# Altium project InterfaceB.PrjPcb (part 1 of 2)
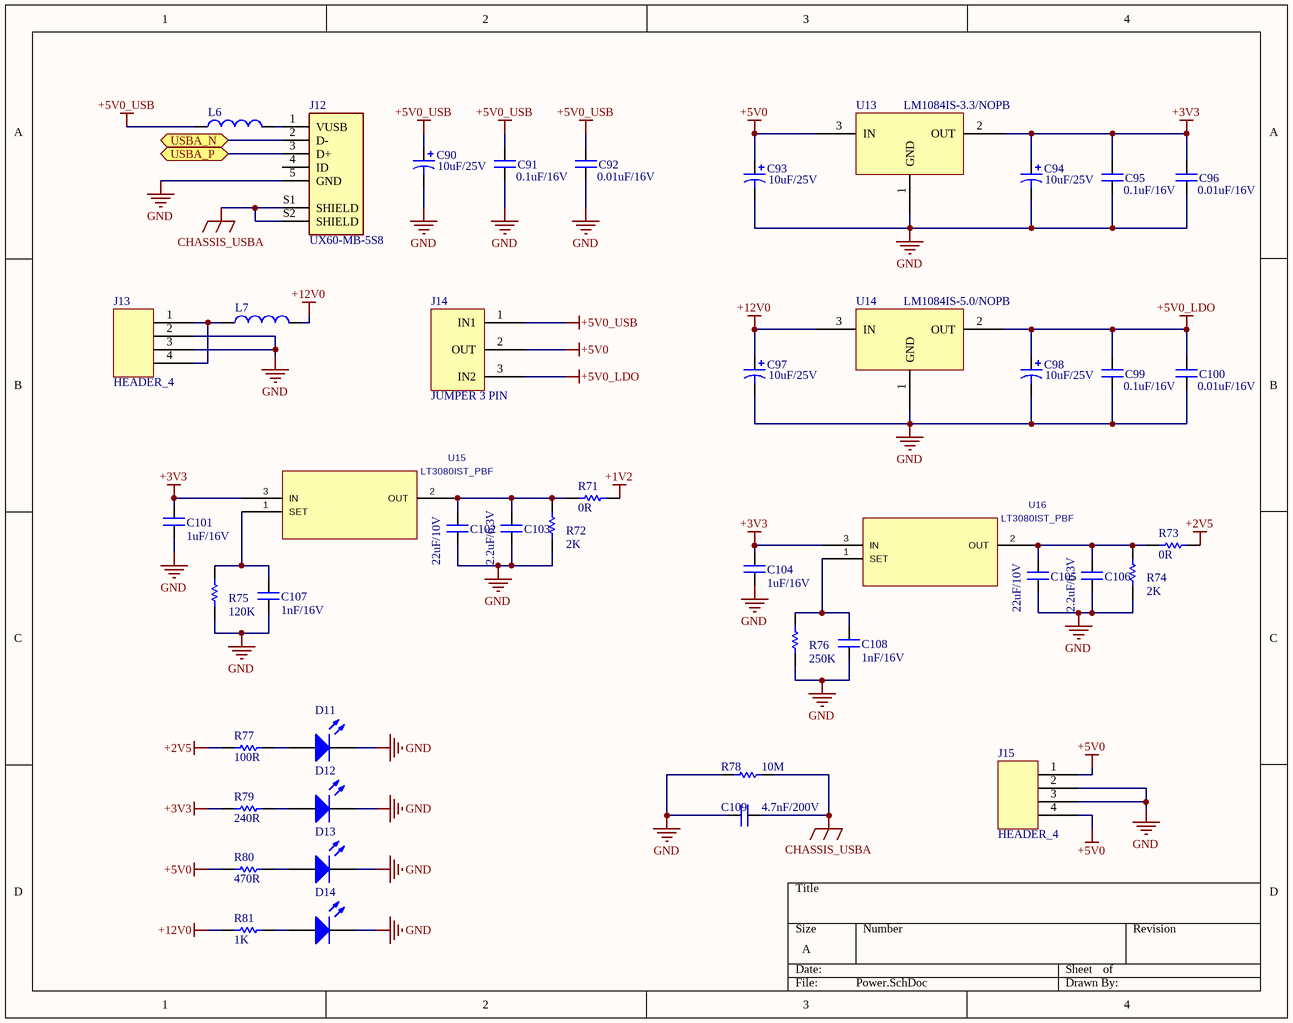
[diagram p0: Power.SchDoc]
12 sheets, 260 parts. Net scope: flat (ports and power ports of the same name join across sheets).
Board file: PCB1.PcbDoc
Sheets:
  Power.SchDoc
  InterfacesB_FPGA.SchDoc
  InterfacesB_Decoupling.SchDoc
  InterfacesB_NONISO232a.SchDoc
  InterfacesB_NONISO232b.SchDoc
  InterfacesB_NONISO422a.SchDoc
  InterfacesB_NONISO422b.SchDoc
  InterfacesB_RGMII_Ethernet.SchDoc
  InterfacesA_USBFTDI.SchDoc
  InterfacesB_SHIFTER_LEDS.SchDoc
  InterfacesB_CONNECTORS.SchDoc
  Mechanical.SchDoc

## Sheet Power.SchDoc
size A; DocumentNumber: 1; SheetNumber: 1

### Parts
C90  value 10uF/25V  [CASE-C]  (hidden comment: CASE-C)
C91  value 0.1uF/16V  [CAP_0805]  (hidden comment: CAP_0805)
C92  value 0.01uF/16V  [CAP_0805]  (hidden comment: CAP_0805)
C93  value 10uF/25V  [CASE-C]  (hidden comment: CASE-C)
C94  value 10uF/25V  [CASE-C]  (hidden comment: CASE-C)
C95  value 0.1uF/16V  [CAP_0805]  (hidden comment: CAP_0805)
C96  value 0.01uF/16V  [CAP_0805]  (hidden comment: CAP_0805)
C97  value 10uF/25V  [CASE-C]  (hidden comment: CASE-C)
C98  value 10uF/25V  [CASE-C]  (hidden comment: CASE-C)
C99  value 0.1uF/16V  [CAP_0805]  (hidden comment: CAP_0805)
C100  value 0.01uF/16V  [CAP_0805]  (hidden comment: CAP_0805)
C101  value 1uF/16V  [CAP_0805]  (hidden comment: CAP_0805)
C102  value 22uF/10V  [CAP_0805]  (hidden comment: CAP_0805)
C103  value 2.2uF/6.3V  [CAP_0805]  (hidden comment: CAP_0805)
C104  value 1uF/16V  [CAP_0805]  (hidden comment: CAP_0805)
C105  value 22uF/10V  [CAP_0805]  (hidden comment: CAP_0805)
C106  value 2.2uF/6.3V  [CAP_0805]  (hidden comment: CAP_0805)
C107  value 1nF/16V  [CAP_0805]  (hidden comment: CAP_0805)
C108  value 1nF/16V  [CAP_0805]  (hidden comment: CAP_0805)
C109  value 4.7nF/200V  [CAP_0805]  (hidden comment: CAP_0805)
D11  LED_0603  [LED_0603]  (value not drawn)
D12  LED_0603  [LED_0603]  (value not drawn)
D13  LED_0603  [LED_0603]  (value not drawn)
D14  LED_0603  [LED_0603]  (value not drawn)
J12  UX60-MB-5S8  [UX60-MB-5S8]
J13  HEADER_4  [HEADER_4]
J14  JUMPER 3 PIN  [JUMPER 3 PIN]
J15  HEADER_4  [HEADER_4]
L6  IND_0805  [IND_0805]  (value not drawn)
L7  IND_0805  [IND_0805]  (value not drawn)
R71  value 0R  [RES_0805]  (hidden comment: RES_0805)
R72  value 2K  [RES_0805]  (hidden comment: RES_0805)
R73  value 0R  [RES_0805]  (hidden comment: RES_0805)
R74  value 2K  [RES_0805]  (hidden comment: RES_0805)
R75  value 120K  [RES_0805]  (hidden comment: RES_0805)
R76  value 250K  [RES_0805]  (hidden comment: RES_0805)
R77  value 100R  [RES_0805]  (hidden comment: RES_0805)
R78  value 10M  [RES_0805]  (hidden comment: RES_0805)
R79  value 240R  [RES_0805]  (hidden comment: RES_0805)
R80  value 470R  [RES_0805]  (hidden comment: RES_0805)
R81  value 1K  [RES_0805]  (hidden comment: RES_0805)
U13  LM1084IS-3.3/NOPB  [LM1084IS-3.3/NOPB]
U14  LM1084IS-5.0/NOPB  [LM1084IS-5.0/NOPB]
U15  LT3080IST_PBF  [LT3080IST_PBF]
U16  LT3080IST_PBF  [LT3080IST_PBF]

### Ports
USBA_N (bidir), USBA_P (bidir)

### Nets
+1V2: R71.1
+2V5: R73.1 R77.1
+3V3: C94.A C95.2 C96.2 C101.2 C104.2 R79.1 U13.2(OUT) U15.3(IN) U16.3(IN)
+5V0: C93.A J14.2(OUT) J15.1 J15.4 R80.1 U13.3(IN)
+5V0_LDO: C98.A C99.2 C100.2 J14.3(IN2) U14.2(OUT)
+5V0_USB: C90.A C91.2 C92.2 J14.1(IN1) L6.1
+12V0: C97.A L7.2 R81.1 U14.3(IN)
CHASSIS_USBA: C109.1 J12.S1(SHIELD) J12.S2(SHIELD) R78.1
GND: C90.K C91.1 C92.1 C93.K C94.K C95.1 C96.1 C97.K C98.K C99.1 C100.1 C101.1 C102.1 C103.1 C104.1 C105.1 C106.1 C107.1 C108.1 C109.2 D11.2(K) D12.2(K) D13.2(K) D14.2(K) J12.5(GND) J13.2 J13.3 J15.2 J15.3 R72.1 R74.1 R75.1 R76.1 R78.2 U13.1(GND) U14.1(GND)
USBA_N: J12.2(D-) ; port USBA_N
USBA_P: J12.3(D+) ; port USBA_P
NetC102_2: C102.2 C103.2 R71.2 R72.2 U15.2(OUT)
NetC105_2: C105.2 C106.2 R73.2 R74.2 U16.2(OUT)
NetC107_2: C107.2 R75.2 U15.1(SET)
NetC108_2: C108.2 R76.2 U16.1(SET)
NetD11_1: D11.1(A) R77.2
NetD12_1: D12.1(A) R79.2
NetD13_1: D13.1(A) R80.2
NetD14_1: D14.1(A) R81.2
NetJ12_1: J12.1(VUSB) L6.2
NetJ13_1: J13.1 J13.4 L7.1

Not connected (* = marked no-connect by the designer): J12 4(ID)

### Library data of the parts
J12 = UX60-MB-5S8: USB MINI TYPE B
U15 U16 = LT3080IST_PBF: Manufacturer_Part_Number: LT3080IST#PBF; Vendor: Linear Technology; SourceLibrary: LinearTech_2016-05-13_3; Built_By: EMA_UL_Team; Value: LT3080IST_PBF
U13 = LM1084IS-3.3/NOPB: Supplier 1: Digi-Key; Supplier Part Number 1: 296-35390-1-ND
U14 = LM1084IS-5.0/NOPB: Supplier 1: Digi-Key; Supplier Part Number 1: 296-35390-1-ND

## Sheet InterfacesB_FPGA.SchDoc
size A; DocumentNumber: 2; SheetNumber: 2
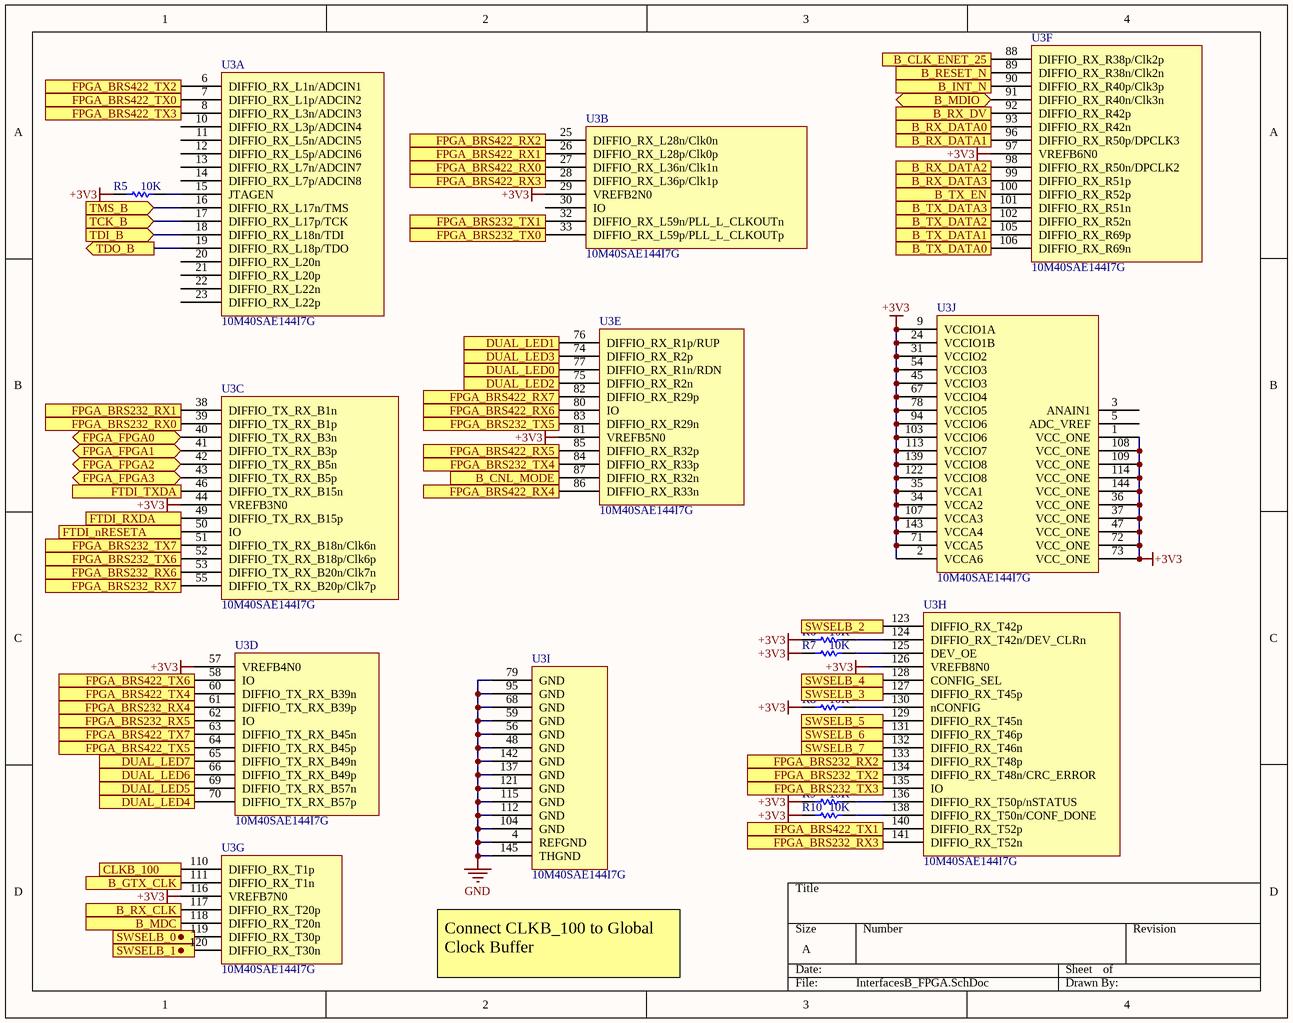
[diagram p1: InterfacesB_FPGA.SchDoc]

### Parts
R5  value 10K  [RES_0805]  (hidden comment: RES_0805)
R6  value 10K  [RES_0805]  (hidden comment: RES_0805)
R7  value 10K  [RES_0805]  (hidden comment: RES_0805)
R8  value 10K  [RES_0805]  (hidden comment: RES_0805)
R9  value 10K  [RES_0805]  (hidden comment: RES_0805)
R10  value 10K  [RES_0805]  (hidden comment: RES_0805)
U3  10M40SAE144I7G  [10M40SAE144I7G]  (parts A,B,C,D,E,F,G,H,I,J of 10)

### Ports
B_CLK_ENET_25 (out), B_CNL_MODE (in), B_GTX_CLK (out), B_INT_N (in), B_MDC (out), B_MDIO (bidir), B_RESET_N (out), B_RX_CLK (out), B_RX_DATA0 (in), B_RX_DATA1 (in), B_RX_DATA2 (in), B_RX_DATA3 (in), B_RX_DV (in), B_TX_DATA0 (out), B_TX_DATA1 (out), B_TX_DATA2 (out), B_TX_DATA3 (out), B_TX_EN (out), CLKB_100 (out), DUAL_LED0 (out), DUAL_LED1 (out), DUAL_LED2 (out), DUAL_LED3 (out), DUAL_LED4 (out), DUAL_LED5 (out), DUAL_LED6 (out), DUAL_LED7 (out), FPGA_BRS232_RX0 (in), FPGA_BRS232_RX1 (in), FPGA_BRS232_RX2 (in), FPGA_BRS232_RX3 (in), FPGA_BRS232_RX4 (in), FPGA_BRS232_RX5 (in), FPGA_BRS232_RX6 (in), FPGA_BRS232_RX7 (in), FPGA_BRS232_TX0 (out), FPGA_BRS232_TX1 (out), FPGA_BRS232_TX2 (out), FPGA_BRS232_TX3 (out), FPGA_BRS232_TX4 (out), FPGA_BRS232_TX5 (out), FPGA_BRS232_TX6 (out), FPGA_BRS232_TX7 (out), FPGA_BRS422_RX0 (in), FPGA_BRS422_RX1 (in), FPGA_BRS422_RX2 (in), FPGA_BRS422_RX3 (in), FPGA_BRS422_RX4 (in), FPGA_BRS422_RX5 (in), FPGA_BRS422_RX6 (in), FPGA_BRS422_RX7 (in), FPGA_BRS422_TX0 (out), FPGA_BRS422_TX1 (out), FPGA_BRS422_TX2 (out), FPGA_BRS422_TX3 (out), FPGA_BRS422_TX4 (out), FPGA_BRS422_TX5 (out), FPGA_BRS422_TX6 (out), FPGA_BRS422_TX7 (out), FPGA_FPGA0 (bidir), FPGA_FPGA1 (bidir), FPGA_FPGA2 (bidir), FPGA_FPGA3 (bidir), FTDI_nRESETA (out), FTDI_RXDA (in), FTDI_TXDA (out), SWSELB_0 (in), SWSELB_1 (in), SWSELB_2 (in), SWSELB_3 (in), SWSELB_4 (in), SWSELB_5 (in), SWSELB_6 (in), SWSELB_7 (in), TCK_B (in), TDI_B (in), TDO_B (out), TMS_B (in)

### Nets
+3V3: R5.2 R6.2 R7.2 R8.2 R9.2 R10.2 U3.1(VCC_ONE) U3.2(VCCA6) U3.9(VCCIO1A) U3.24(VCCIO1B) U3.29(VREFB2N0) U3.31(VCCIO2) U3.34(VCCA2) U3.35(VCCA1) U3.36(VCC_ONE) U3.37(VCC_ONE) U3.44(VREFB3N0) U3.45(VCCIO3) U3.47(VCC_ONE) U3.54(VCCIO3) U3.57(VREFB4N0) U3.67(VCCIO4) U3.71(VCCA5) U3.72(VCC_ONE) U3.73(VCC_ONE) U3.78(VCCIO5) U3.81(VREFB5N0) U3.94(VCCIO6) U3.97(VREFB6N0) U3.103(VCCIO6) U3.107(VCCA3) U3.108(VCC_ONE) U3.109(VCC_ONE) U3.113(VCCIO7) U3.114(VCC_ONE) U3.116(VREFB7N0) U3.122(VCCIO8) U3.126(VREFB8N0) U3.139(VCCIO8) U3.143(VCCA4) U3.144(VCC_ONE)
GND: U3.4(REFGND) U3.48(GND) U3.56(GND) U3.59(GND) U3.68(GND) U3.79(GND) U3.95(GND) U3.104(GND) U3.112(GND) U3.115(GND) U3.121(GND) U3.137(GND) U3.142(GND) U3.145(THGND)
CLK_ENET_25: U3.88(DIFFIO_RX_R38p/Clk2p) ; port B_CLK_ENET_25
CLKB_100: U3.110(DIFFIO_RX_T1p) ; port CLKB_100
CNL_MODE: U3.87(DIFFIO_RX_R32n) ; port B_CNL_MODE
FPGA_BRS232_RX0: U3.39(DIFFIO_TX_RX_B1p) ; port FPGA_BRS232_RX0
FPGA_BRS232_RX1: U3.38(DIFFIO_TX_RX_B1n) ; port FPGA_BRS232_RX1
FPGA_BRS232_RX2: U3.133(DIFFIO_RX_T48p) ; port FPGA_BRS232_RX2
FPGA_BRS232_RX3: U3.141(DIFFIO_RX_T52n) ; port FPGA_BRS232_RX3
FPGA_BRS232_RX4: U3.61(DIFFIO_TX_RX_B39p) ; port FPGA_BRS232_RX4
FPGA_BRS232_RX5: U3.62(IO) ; port FPGA_BRS232_RX5
FPGA_BRS232_RX6: U3.53(DIFFIO_TX_RX_B20n/Clk7n) ; port FPGA_BRS232_RX6
FPGA_BRS232_RX7: U3.55(DIFFIO_TX_RX_B20p/Clk7p) ; port FPGA_BRS232_RX7
FPGA_BRS232_TX0: U3.33(DIFFIO_RX_L59p/PLL_L_CLKOUTp) ; port FPGA_BRS232_TX0
FPGA_BRS232_TX1: U3.32(DIFFIO_RX_L59n/PLL_L_CLKOUTn) ; port FPGA_BRS232_TX1
FPGA_BRS232_TX2: U3.134(DIFFIO_RX_T48n/CRC_ERROR) ; port FPGA_BRS232_TX2
FPGA_BRS232_TX3: U3.135(IO) ; port FPGA_BRS232_TX3
FPGA_BRS232_TX4: U3.84(DIFFIO_RX_R33p) ; port FPGA_BRS232_TX4
FPGA_BRS232_TX5: U3.83(DIFFIO_RX_R29n) ; port FPGA_BRS232_TX5
FPGA_BRS232_TX6: U3.52(DIFFIO_TX_RX_B18p/Clk6p) ; port FPGA_BRS232_TX6
FPGA_BRS232_TX7: U3.51(DIFFIO_TX_RX_B18n/Clk6n) ; port FPGA_BRS232_TX7
FPGA_BRS422_RX0: U3.27(DIFFIO_RX_L36n/Clk1n) ; port FPGA_BRS422_RX0
FPGA_BRS422_RX1: U3.26(DIFFIO_RX_L28p/Clk0p) ; port FPGA_BRS422_RX1
FPGA_BRS422_RX2: U3.25(DIFFIO_RX_L28n/Clk0n) ; port FPGA_BRS422_RX2
FPGA_BRS422_RX3: U3.28(DIFFIO_RX_L36p/Clk1p) ; port FPGA_BRS422_RX3
FPGA_BRS422_RX4: U3.86(DIFFIO_RX_R33n) ; port FPGA_BRS422_RX4
FPGA_BRS422_RX5: U3.85(DIFFIO_RX_R32p) ; port FPGA_BRS422_RX5
FPGA_BRS422_RX6: U3.80(IO) ; port FPGA_BRS422_RX6
FPGA_BRS422_RX7: U3.82(DIFFIO_RX_R29p) ; port FPGA_BRS422_RX7
FPGA_BRS422_TX0: U3.7(DIFFIO_RX_L1p/ADCIN2) ; port FPGA_BRS422_TX0
FPGA_BRS422_TX1: U3.140(DIFFIO_RX_T52p) ; port FPGA_BRS422_TX1
FPGA_BRS422_TX2: U3.6(DIFFIO_RX_L1n/ADCIN1) ; port FPGA_BRS422_TX2
FPGA_BRS422_TX3: U3.8(DIFFIO_RX_L3n/ADCIN3) ; port FPGA_BRS422_TX3
FPGA_BRS422_TX4: U3.60(DIFFIO_TX_RX_B39n) ; port FPGA_BRS422_TX4
FPGA_BRS422_TX5: U3.64(DIFFIO_TX_RX_B45p) ; port FPGA_BRS422_TX5
FPGA_BRS422_TX6: U3.58(IO) ; port FPGA_BRS422_TX6
FPGA_BRS422_TX7: U3.63(DIFFIO_TX_RX_B45n) ; port FPGA_BRS422_TX7
FPGA_FPGA0: U3.40(DIFFIO_TX_RX_B3n) ; port FPGA_FPGA0
FPGA_FPGA1: U3.41(DIFFIO_TX_RX_B3p) ; port FPGA_FPGA1
FPGA_FPGA2: U3.42(DIFFIO_TX_RX_B5n) ; port FPGA_FPGA2
FPGA_FPGA3: U3.43(DIFFIO_TX_RX_B5p) ; port FPGA_FPGA3
FTDI_RXDA: U3.49(DIFFIO_TX_RX_B15p) ; port FTDI_RXDA
FTDI_TXDA: U3.46(DIFFIO_TX_RX_B15n) ; port FTDI_TXDA
GTX_CLK: U3.111(DIFFIO_RX_T1n) ; port B_GTX_CLK
INT_N: U3.90(DIFFIO_RX_R40p/Clk3p) ; port B_INT_N
L0: U3.77(DIFFIO_RX_R1n/RDN) ; port DUAL_LED0
L1: U3.76(DIFFIO_RX_R1p/RUP) ; port DUAL_LED1
L2: U3.75(DIFFIO_RX_R2n) ; port DUAL_LED2
L3: U3.74(DIFFIO_RX_R2p) ; port DUAL_LED3
L4: U3.70(DIFFIO_TX_RX_B57p) ; port DUAL_LED4
L5: U3.69(DIFFIO_TX_RX_B57n) ; port DUAL_LED5
L6: U3.66(DIFFIO_TX_RX_B49p) ; port DUAL_LED6
L7: U3.65(DIFFIO_TX_RX_B49n) ; port DUAL_LED7
MDC: U3.118(DIFFIO_RX_T20n) ; port B_MDC
MDIO: U3.91(DIFFIO_RX_R40n/Clk3n) ; port B_MDIO
RESET_N: U3.89(DIFFIO_RX_R38n/Clk2n) ; port B_RESET_N
RST_A: U3.50(IO) ; port FTDI_nRESETA
RX_CLK: U3.117(DIFFIO_RX_T20p) ; port B_RX_CLK
RX_DATA0: U3.93(DIFFIO_RX_R42n) ; port B_RX_DATA0
RX_DATA1: U3.96(DIFFIO_RX_R50p/DPCLK3) ; port B_RX_DATA1
RX_DATA2: U3.98(DIFFIO_RX_R50n/DPCLK2) ; port B_RX_DATA2
RX_DATA3: U3.99(DIFFIO_RX_R51p) ; port B_RX_DATA3
RX_DV: U3.92(DIFFIO_RX_R42p) ; port B_RX_DV
SWSELB_2: U3.123(DIFFIO_RX_T42p) ; port SWSELB_2
SWSELB_3: U3.127(DIFFIO_RX_T45p) ; port SWSELB_3
SWSELB_4: U3.128(CONFIG_SEL) ; port SWSELB_4
SWSELB_5: U3.129(DIFFIO_RX_T45n) ; port SWSELB_5
SWSELB_6: U3.131(DIFFIO_RX_T46p) ; port SWSELB_6
SWSELB_7: U3.132(DIFFIO_RX_T46n) ; port SWSELB_7
TCK_B: U3.17(DIFFIO_RX_L17p/TCK) ; port TCK_B
TDI_B: U3.18(DIFFIO_RX_L18n/TDI) ; port TDI_B
TDO_B: U3.19(DIFFIO_RX_L18p/TDO) ; port TDO_B
TMS_B: U3.16(DIFFIO_RX_L17n/TMS) ; port TMS_B
TX_DATA0: U3.106(DIFFIO_RX_R69n) ; port B_TX_DATA0
TX_DATA1: U3.105(DIFFIO_RX_R69p) ; port B_TX_DATA1
TX_DATA2: U3.102(DIFFIO_RX_R52n) ; port B_TX_DATA2
TX_DATA3: U3.101(DIFFIO_RX_R51n) ; port B_TX_DATA3
TX_EN: U3.100(DIFFIO_RX_R52p) ; port B_TX_EN
NetR5_1: R5.1 U3.15(JTAGEN)
NetR6_1: R6.1 U3.124(DIFFIO_RX_T42n/DEV_CLRn)
NetR7_1: R7.1 U3.125(DEV_OE)
NetR8_1: R8.1 U3.130(nCONFIG)
NetR9_1: R9.1 U3.136(DIFFIO_RX_T50p/nSTATUS)
NetR10_1: R10.1 U3.138(DIFFIO_RX_T50n/CONF_DONE)

Not connected (* = marked no-connect by the designer): U3 3(ANAIN1) 5(ADC_VREF) 10(DIFFIO_RX_L3p/ADCIN4) 11(DIFFIO_RX_L5n/ADCIN5) 12(DIFFIO_RX_L5p/ADCIN6) 13(DIFFIO_RX_L7n/ADCIN7) 14(DIFFIO_RX_L7p/ADCIN8) 20(DIFFIO_RX_L20n) 21(DIFFIO_RX_L20p) 22(DIFFIO_RX_L22n) 23(DIFFIO_RX_L22p) 30(IO) 119(DIFFIO_RX_T30p) 120(DIFFIO_RX_T30n)

### Notes on the sheet
- Connect CLKB_100 to Global Clock Buffer

### Library data of the parts
U3 = 10M40SAE144I7G: IC FPGA 101 I/O 144EQFP

## Sheet InterfacesB_Decoupling.SchDoc
size A; DocumentNumber: 3; SheetNumber: 3
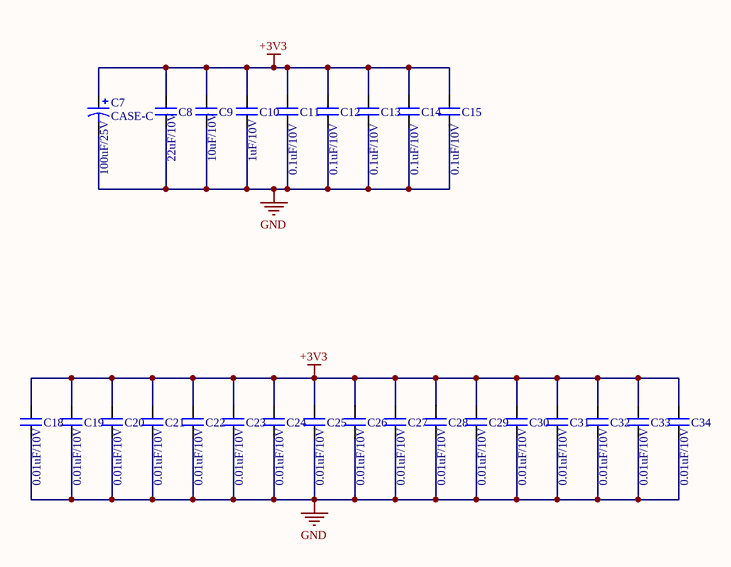
[diagram p2: InterfacesB_Decoupling.SchDoc]

### Parts
C7  CASE-C  value 100uF/25V  [CASE-C]
C8  value 22uF/10V  [CAP_0805]  (hidden comment: CAP_0805)
C9  value 10uF/10V  [CAP_0805]  (hidden comment: CAP_0805)
C10  value 1uF/10V  [CAP_0805]  (hidden comment: CAP_0805)
C11  value 0.1uF/10V  [CAP_0805]  (hidden comment: CAP_0805)
C12  value 0.1uF/10V  [CAP_0805]  (hidden comment: CAP_0805)
C13  value 0.1uF/10V  [CAP_0805]  (hidden comment: CAP_0805)
C14  value 0.1uF/10V  [CAP_0805]  (hidden comment: CAP_0805)
C15  value 0.1uF/10V  [CAP_0805]  (hidden comment: CAP_0805)
C18  value 0.01uF/10V  [CAP_0805]  (hidden comment: CAP_0805)
C19  value 0.01uF/10V  [CAP_0805]  (hidden comment: CAP_0805)
C20  value 0.01uF/10V  [CAP_0805]  (hidden comment: CAP_0805)
C21  value 0.01uF/10V  [CAP_0805]  (hidden comment: CAP_0805)
C22  value 0.01uF/10V  [CAP_0805]  (hidden comment: CAP_0805)
C23  value 0.01uF/10V  [CAP_0805]  (hidden comment: CAP_0805)
C24  value 0.01uF/10V  [CAP_0805]  (hidden comment: CAP_0805)
C25  value 0.01uF/10V  [CAP_0805]  (hidden comment: CAP_0805)
C26  value 0.01uF/10V  [CAP_0805]  (hidden comment: CAP_0805)
C27  value 0.01uF/10V  [CAP_0805]  (hidden comment: CAP_0805)
C28  value 0.01uF/10V  [CAP_0805]  (hidden comment: CAP_0805)
C29  value 0.01uF/10V  [CAP_0805]  (hidden comment: CAP_0805)
C30  value 0.01uF/10V  [CAP_0805]  (hidden comment: CAP_0805)
C31  value 0.01uF/10V  [CAP_0805]  (hidden comment: CAP_0805)
C32  value 0.01uF/10V  [CAP_0805]  (hidden comment: CAP_0805)
C33  value 0.01uF/10V  [CAP_0805]  (hidden comment: CAP_0805)
C34  value 0.01uF/10V  [CAP_0805]  (hidden comment: CAP_0805)

### Nets
+3V3: C7.A C8.2 C9.2 C10.2 C11.2 C12.2 C13.2 C14.2 C15.2 C18.2 C19.2 C20.2 C21.2 C22.2 C23.2 C24.2 C25.2 C26.2 C27.2 C28.2 C29.2 C30.2 C31.2 C32.2 C33.2 C34.2
GND: C7.K C8.1 C9.1 C10.1 C11.1 C12.1 C13.1 C14.1 C15.1 C18.1 C19.1 C20.1 C21.1 C22.1 C23.1 C24.1 C25.1 C26.1 C27.1 C28.1 C29.1 C30.1 C31.1 C32.1 C33.1 C34.1

## Sheet InterfacesB_NONISO232a.SchDoc
size A; DocumentNumber: 4; SheetNumber: 4
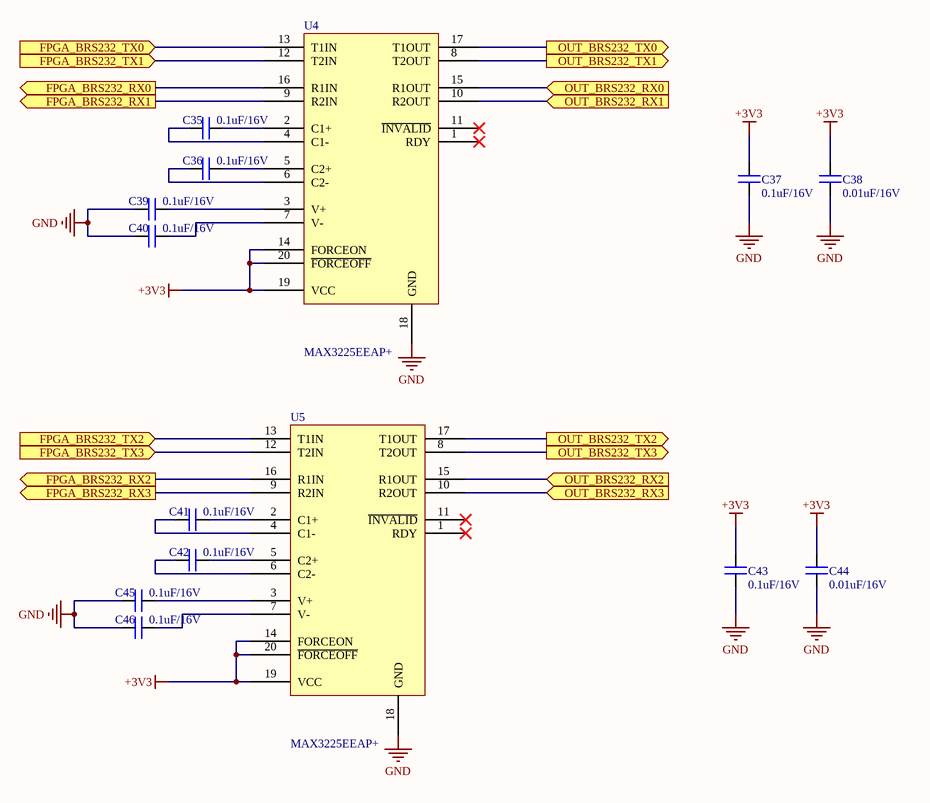
[diagram p3: InterfacesB_NONISO232a.SchDoc]

### Parts
C35  value 0.1uF/16V  [CAP_0805]  (hidden comment: CAP_0805)
C36  value 0.1uF/16V  [CAP_0805]  (hidden comment: CAP_0805)
C37  value 0.1uF/16V  [CAP_0805]  (hidden comment: CAP_0805)
C38  value 0.01uF/16V  [CAP_0805]  (hidden comment: CAP_0805)
C39  value 0.1uF/16V  [CAP_0805]  (hidden comment: CAP_0805)
C40  value 0.1uF/16V  [CAP_0805]  (hidden comment: CAP_0805)
C41  value 0.1uF/16V  [CAP_0805]  (hidden comment: CAP_0805)
C42  value 0.1uF/16V  [CAP_0805]  (hidden comment: CAP_0805)
C43  value 0.1uF/16V  [CAP_0805]  (hidden comment: CAP_0805)
C44  value 0.01uF/16V  [CAP_0805]  (hidden comment: CAP_0805)
C45  value 0.1uF/16V  [CAP_0805]  (hidden comment: CAP_0805)
C46  value 0.1uF/16V  [CAP_0805]  (hidden comment: CAP_0805)
U4  MAX3225EEAP+  [MAX3225EEAP+]
U5  MAX3225EEAP+  [MAX3225EEAP+]

### Ports
FPGA_BRS232_RX0 (out), FPGA_BRS232_RX1 (out), FPGA_BRS232_RX2 (out), FPGA_BRS232_RX3 (out), FPGA_BRS232_TX0 (in), FPGA_BRS232_TX1 (in), FPGA_BRS232_TX2 (in), FPGA_BRS232_TX3 (in), OUT_BRS232_RX0 (in), OUT_BRS232_RX1 (in), OUT_BRS232_RX2 (in), OUT_BRS232_RX3 (in), OUT_BRS232_TX0 (out), OUT_BRS232_TX1 (out), OUT_BRS232_TX2 (out), OUT_BRS232_TX3 (out)

### Nets
+3V3: C37.1 C38.1 C43.1 C44.1 U4.14(FORCEON) U4.19(VCC) U4.20(~{FORCEOFF}) U5.14(FORCEON) U5.19(VCC) U5.20(~{FORCEOFF})
GND: C37.2 C38.2 C39.2 C40.2 C43.2 C44.2 C45.2 C46.2 U4.18(GND) U5.18(GND)
FPGA_BRS232_RX0: U4.16(R1IN) ; port FPGA_BRS232_RX0
FPGA_BRS232_RX1: U4.9(R2IN) ; port FPGA_BRS232_RX1
FPGA_BRS232_RX2: U5.16(R1IN) ; port FPGA_BRS232_RX2
FPGA_BRS232_RX3: U5.9(R2IN) ; port FPGA_BRS232_RX3
FPGA_BRS232_TX0: U4.13(T1IN) ; port FPGA_BRS232_TX0
FPGA_BRS232_TX1: U4.12(T2IN) ; port FPGA_BRS232_TX1
FPGA_BRS232_TX2: U5.13(T1IN) ; port FPGA_BRS232_TX2
FPGA_BRS232_TX3: U5.12(T2IN) ; port FPGA_BRS232_TX3
OUT_BRS232_RX0: U4.15(R1OUT) ; port OUT_BRS232_RX0
OUT_BRS232_RX1: U4.10(R2OUT) ; port OUT_BRS232_RX1
OUT_BRS232_RX2: U5.15(R1OUT) ; port OUT_BRS232_RX2
OUT_BRS232_RX3: U5.10(R2OUT) ; port OUT_BRS232_RX3
OUT_BRS232_TX0: U4.17(T1OUT) ; port OUT_BRS232_TX0
OUT_BRS232_TX1: U4.8(T2OUT) ; port OUT_BRS232_TX1
OUT_BRS232_TX2: U5.17(T1OUT) ; port OUT_BRS232_TX2
OUT_BRS232_TX3: U5.8(T2OUT) ; port OUT_BRS232_TX3
NetC35_1: C35.1 U4.2(C1+)
NetC35_2: C35.2 U4.4(C1-)
NetC36_1: C36.1 U4.5(C2+)
NetC36_2: C36.2 U4.6(C2-)
NetC39_1: C39.1 U4.3(V+)
NetC40_1: C40.1 U4.7(V-)
NetC41_1: C41.1 U5.2(C1+)
NetC41_2: C41.2 U5.4(C1-)
NetC42_1: C42.1 U5.5(C2+)
NetC42_2: C42.2 U5.6(C2-)
NetC45_1: C45.1 U5.3(V+)
NetC46_1: C46.1 U5.7(V-)

Not connected (* = marked no-connect by the designer): U4 1(RDY)* 11(~{INVALID})*; U5 1(RDY)* 11(~{INVALID})*

### Library data of the parts
U4 U5 = MAX3225EEAP+: Supplier 1: Digi-Key; Supplier Part Number 1: MAX3225EEAP+-ND

## Sheet InterfacesB_NONISO232b.SchDoc
size A; DocumentNumber: 5; SheetNumber: 5
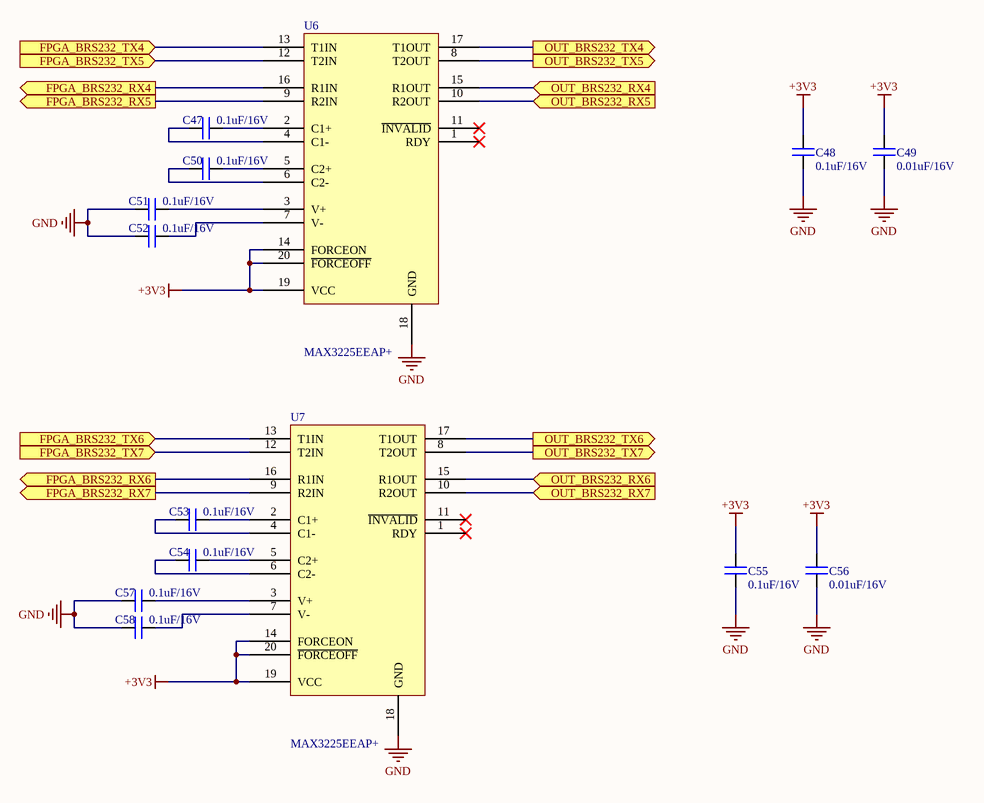
[diagram p4: InterfacesB_NONISO232b.SchDoc]

### Parts
C47  value 0.1uF/16V  [CAP_0805]  (hidden comment: CAP_0805)
C48  value 0.1uF/16V  [CAP_0805]  (hidden comment: CAP_0805)
C49  value 0.01uF/16V  [CAP_0805]  (hidden comment: CAP_0805)
C50  value 0.1uF/16V  [CAP_0805]  (hidden comment: CAP_0805)
C51  value 0.1uF/16V  [CAP_0805]  (hidden comment: CAP_0805)
C52  value 0.1uF/16V  [CAP_0805]  (hidden comment: CAP_0805)
C53  value 0.1uF/16V  [CAP_0805]  (hidden comment: CAP_0805)
C54  value 0.1uF/16V  [CAP_0805]  (hidden comment: CAP_0805)
C55  value 0.1uF/16V  [CAP_0805]  (hidden comment: CAP_0805)
C56  value 0.01uF/16V  [CAP_0805]  (hidden comment: CAP_0805)
C57  value 0.1uF/16V  [CAP_0805]  (hidden comment: CAP_0805)
C58  value 0.1uF/16V  [CAP_0805]  (hidden comment: CAP_0805)
U6  MAX3225EEAP+  [MAX3225EEAP+]
U7  MAX3225EEAP+  [MAX3225EEAP+]

### Ports
FPGA_BRS232_RX4 (out), FPGA_BRS232_RX5 (out), FPGA_BRS232_RX6 (out), FPGA_BRS232_RX7 (out), FPGA_BRS232_TX4 (in), FPGA_BRS232_TX5 (in), FPGA_BRS232_TX6 (in), FPGA_BRS232_TX7 (in), OUT_BRS232_RX4 (in), OUT_BRS232_RX5 (in), OUT_BRS232_RX6 (in), OUT_BRS232_RX7 (in), OUT_BRS232_TX4 (out), OUT_BRS232_TX5 (out), OUT_BRS232_TX6 (out), OUT_BRS232_TX7 (out)

### Nets
+3V3: C48.1 C49.1 C55.1 C56.1 U6.14(FORCEON) U6.19(VCC) U6.20(~{FORCEOFF}) U7.14(FORCEON) U7.19(VCC) U7.20(~{FORCEOFF})
GND: C48.2 C49.2 C51.2 C52.2 C55.2 C56.2 C57.2 C58.2 U6.18(GND) U7.18(GND)
FPGA_BRS232_RX4: U6.16(R1IN) ; port FPGA_BRS232_RX4
FPGA_BRS232_RX5: U6.9(R2IN) ; port FPGA_BRS232_RX5
FPGA_BRS232_RX6: U7.16(R1IN) ; port FPGA_BRS232_RX6
FPGA_BRS232_RX7: U7.9(R2IN) ; port FPGA_BRS232_RX7
FPGA_BRS232_TX4: U6.13(T1IN) ; port FPGA_BRS232_TX4
FPGA_BRS232_TX5: U6.12(T2IN) ; port FPGA_BRS232_TX5
FPGA_BRS232_TX6: U7.13(T1IN) ; port FPGA_BRS232_TX6
FPGA_BRS232_TX7: U7.12(T2IN) ; port FPGA_BRS232_TX7
OUT_BRS232_RX4: U6.15(R1OUT) ; port OUT_BRS232_RX4
OUT_BRS232_RX5: U6.10(R2OUT) ; port OUT_BRS232_RX5
OUT_BRS232_RX6: U7.15(R1OUT) ; port OUT_BRS232_RX6
OUT_BRS232_RX7: U7.10(R2OUT) ; port OUT_BRS232_RX7
OUT_BRS232_TX4: U6.17(T1OUT) ; port OUT_BRS232_TX4
OUT_BRS232_TX5: U6.8(T2OUT) ; port OUT_BRS232_TX5
OUT_BRS232_TX6: U7.17(T1OUT) ; port OUT_BRS232_TX6
OUT_BRS232_TX7: U7.8(T2OUT) ; port OUT_BRS232_TX7
NetC47_1: C47.1 U6.2(C1+)
NetC47_2: C47.2 U6.4(C1-)
NetC50_1: C50.1 U6.5(C2+)
NetC50_2: C50.2 U6.6(C2-)
NetC51_1: C51.1 U6.3(V+)
NetC52_1: C52.1 U6.7(V-)
NetC53_1: C53.1 U7.2(C1+)
NetC53_2: C53.2 U7.4(C1-)
NetC54_1: C54.1 U7.5(C2+)
NetC54_2: C54.2 U7.6(C2-)
NetC57_1: C57.1 U7.3(V+)
NetC58_1: C58.1 U7.7(V-)

Not connected (* = marked no-connect by the designer): U6 1(RDY)* 11(~{INVALID})*; U7 1(RDY)* 11(~{INVALID})*

### Library data of the parts
U6 U7 = MAX3225EEAP+: Supplier 1: Digi-Key; Supplier Part Number 1: MAX3225EEAP+-ND

## Sheet InterfacesB_NONISO422a.SchDoc
size A; DocumentNumber: 6; SheetNumber: 6
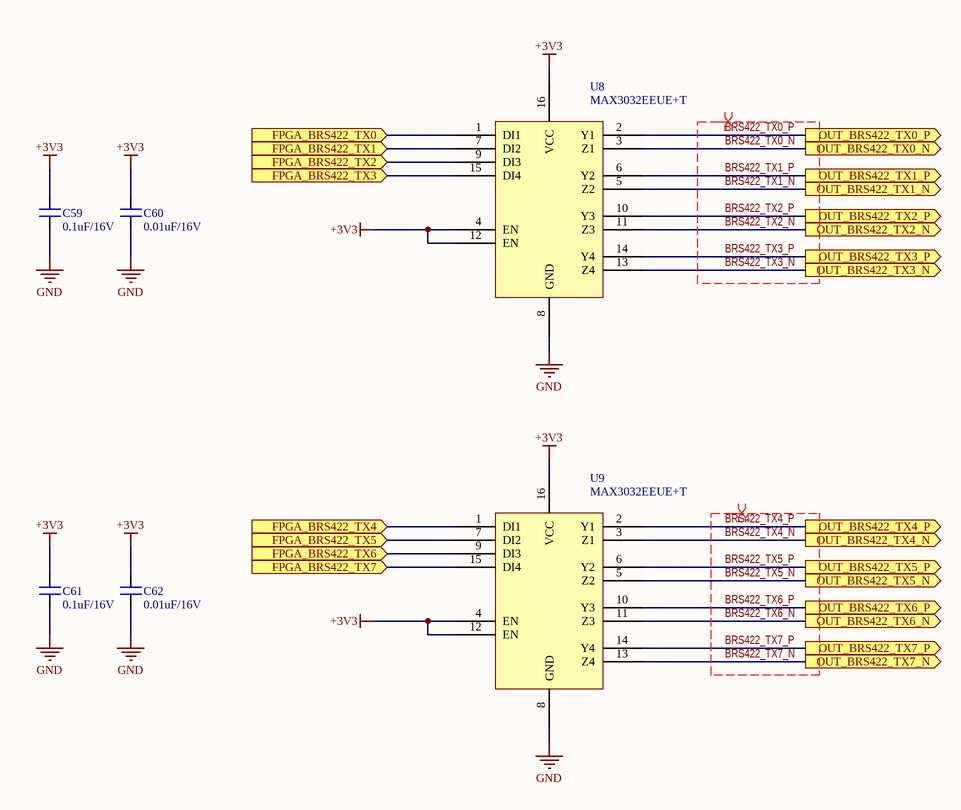
[diagram p5: InterfacesB_NONISO422a.SchDoc]

### Parts
C59  value 0.1uF/16V  [CAP_0805]  (hidden comment: CAP_0805)
C60  value 0.01uF/16V  [CAP_0805]  (hidden comment: CAP_0805)
C61  value 0.1uF/16V  [CAP_0805]  (hidden comment: CAP_0805)
C62  value 0.01uF/16V  [CAP_0805]  (hidden comment: CAP_0805)
U8  MAX3032EEUE+T  [MAX3032EEUE+T]
U9  MAX3032EEUE+T  [MAX3032EEUE+T]

### Ports
FPGA_BRS422_TX0 (in), FPGA_BRS422_TX1 (in), FPGA_BRS422_TX2 (in), FPGA_BRS422_TX3 (in), FPGA_BRS422_TX4 (in), FPGA_BRS422_TX5 (in), FPGA_BRS422_TX6 (in), FPGA_BRS422_TX7 (in), OUT_BRS422_TX0_N (out), OUT_BRS422_TX0_P (out), OUT_BRS422_TX1_N (out), OUT_BRS422_TX1_P (out), OUT_BRS422_TX2_N (out), OUT_BRS422_TX2_P (out), OUT_BRS422_TX3_N (out), OUT_BRS422_TX3_P (out), OUT_BRS422_TX4_N (out), OUT_BRS422_TX4_P (out), OUT_BRS422_TX5_N (out), OUT_BRS422_TX5_P (out), OUT_BRS422_TX6_N (out), OUT_BRS422_TX6_P (out), OUT_BRS422_TX7_N (out), OUT_BRS422_TX7_P (out)

### Nets
+3V3: C59.1 C60.1 C61.1 C62.1 U8.4(EN) U8.12(EN) U8.16(VCC) U9.4(EN) U9.12(EN) U9.16(VCC)
GND: C59.2 C60.2 C61.2 C62.2 U8.8(GND) U9.8(GND)
BRS422_TX0_N: U8.3(Z1) ; port OUT_BRS422_TX0_N
BRS422_TX0_P: U8.2(Y1) ; port OUT_BRS422_TX0_P
BRS422_TX1_N: U8.5(Z2) ; port OUT_BRS422_TX1_N
BRS422_TX1_P: U8.6(Y2) ; port OUT_BRS422_TX1_P
BRS422_TX2_N: U8.11(Z3) ; port OUT_BRS422_TX2_N
BRS422_TX2_P: U8.10(Y3) ; port OUT_BRS422_TX2_P
BRS422_TX3_N: U8.13(Z4) ; port OUT_BRS422_TX3_N
BRS422_TX3_P: U8.14(Y4) ; port OUT_BRS422_TX3_P
BRS422_TX4_N: U9.3(Z1) ; port OUT_BRS422_TX4_N
BRS422_TX4_P: U9.2(Y1) ; port OUT_BRS422_TX4_P
BRS422_TX5_N: U9.5(Z2) ; port OUT_BRS422_TX5_N
BRS422_TX5_P: U9.6(Y2) ; port OUT_BRS422_TX5_P
BRS422_TX6_N: U9.11(Z3) ; port OUT_BRS422_TX6_N
BRS422_TX6_P: U9.10(Y3) ; port OUT_BRS422_TX6_P
BRS422_TX7_N: U9.13(Z4) ; port OUT_BRS422_TX7_N
BRS422_TX7_P: U9.14(Y4) ; port OUT_BRS422_TX7_P
FPGA_BRS422_TX0: U8.1(DI1) ; port FPGA_BRS422_TX0
FPGA_BRS422_TX1: U8.7(DI2) ; port FPGA_BRS422_TX1
FPGA_BRS422_TX2: U8.9(DI3) ; port FPGA_BRS422_TX2
FPGA_BRS422_TX3: U8.15(DI4) ; port FPGA_BRS422_TX3
FPGA_BRS422_TX4: U9.1(DI1) ; port FPGA_BRS422_TX4
FPGA_BRS422_TX5: U9.7(DI2) ; port FPGA_BRS422_TX5
FPGA_BRS422_TX6: U9.9(DI3) ; port FPGA_BRS422_TX6
FPGA_BRS422_TX7: U9.15(DI4) ; port FPGA_BRS422_TX7

### Layout directives
differential pair: BRS422_TX0_N, BRS422_TX0_P, BRS422_TX1_N, BRS422_TX1_P, BRS422_TX2_N, BRS422_TX2_P, BRS422_TX3_N, BRS422_TX3_P, BRS422_TX4_N, BRS422_TX4_P, BRS422_TX5_N, BRS422_TX5_P, BRS422_TX6_N, BRS422_TX6_P, BRS422_TX7_N, BRS422_TX7_P

### Library data of the parts
U8 U9 = MAX3032EEUE+T: Supplier 1: Digi-Key; Supplier Part Number 1: 1016-1522-5-ND

## Sheet InterfacesB_NONISO422b.SchDoc
size A; DocumentNumber: 7; SheetNumber: 7
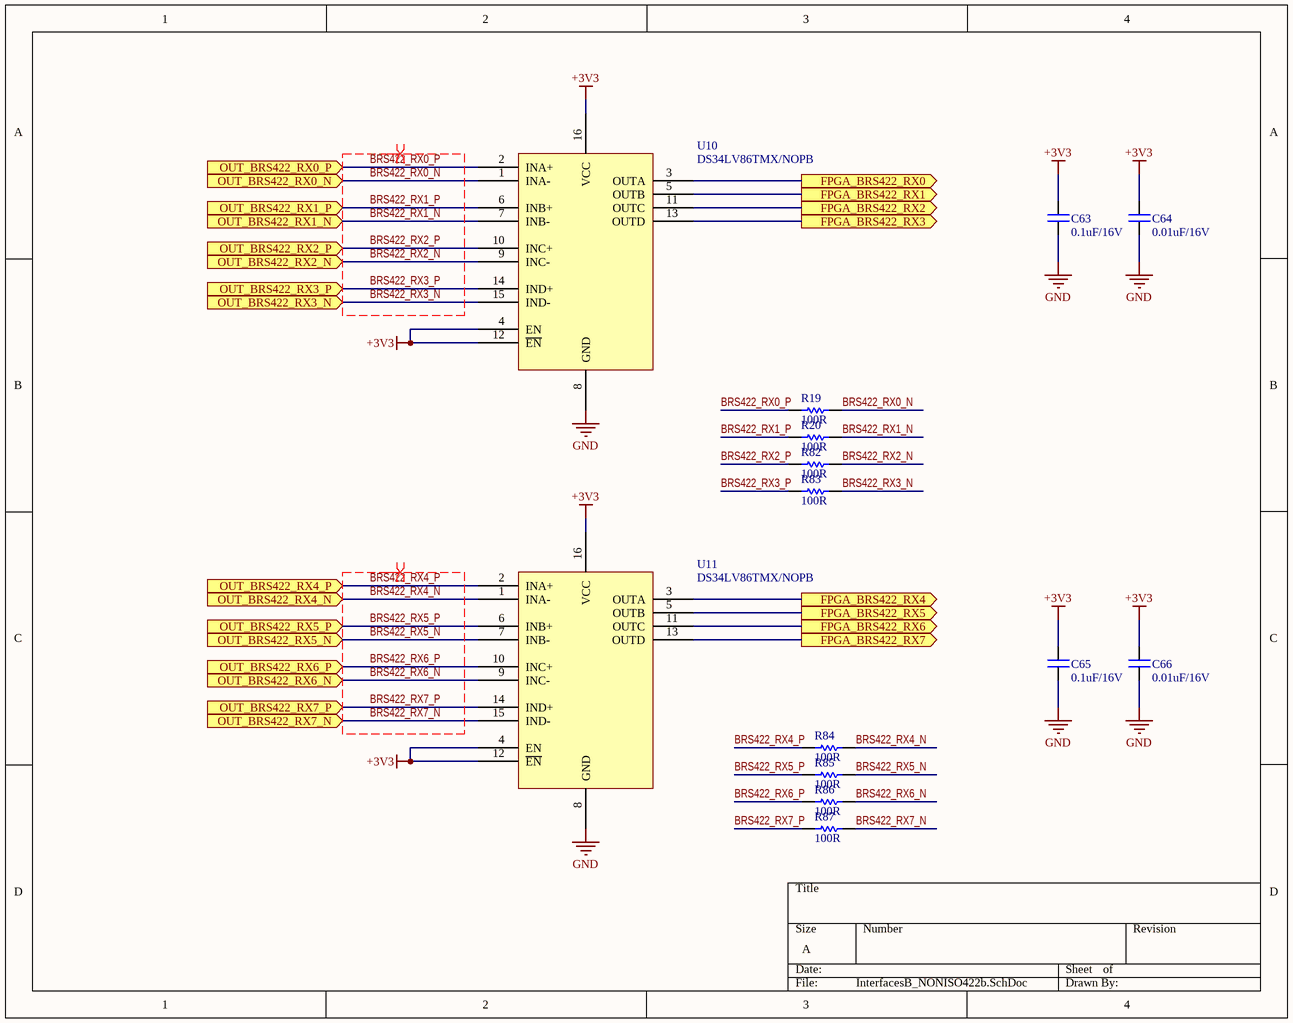
[diagram p6: InterfacesB_NONISO422b.SchDoc]

### Parts
C63  value 0.1uF/16V  [CAP_0805]  (hidden comment: CAP_0805)
C64  value 0.01uF/16V  [CAP_0805]  (hidden comment: CAP_0805)
C65  value 0.1uF/16V  [CAP_0805]  (hidden comment: CAP_0805)
C66  value 0.01uF/16V  [CAP_0805]  (hidden comment: CAP_0805)
R19  value 100R  [RES_0805]  (hidden comment: RES_0805)
R20  value 100R  [RES_0805]  (hidden comment: RES_0805)
R82  value 100R  [RES_0805]  (hidden comment: RES_0805)
R83  value 100R  [RES_0805]  (hidden comment: RES_0805)
R84  value 100R  [RES_0805]  (hidden comment: RES_0805)
R85  value 100R  [RES_0805]  (hidden comment: RES_0805)
R86  value 100R  [RES_0805]  (hidden comment: RES_0805)
R87  value 100R  [RES_0805]  (hidden comment: RES_0805)
U10  DS34LV86TMX/NOPB  [DS34LV86TMX/NOPB]
U11  DS34LV86TMX/NOPB  [DS34LV86TMX/NOPB]

### Ports
FPGA_BRS422_RX0 (out), FPGA_BRS422_RX1 (out), FPGA_BRS422_RX2 (out), FPGA_BRS422_RX3 (out), FPGA_BRS422_RX4 (out), FPGA_BRS422_RX5 (out), FPGA_BRS422_RX6 (out), FPGA_BRS422_RX7 (out), OUT_BRS422_RX0_N (in), OUT_BRS422_RX0_P (in), OUT_BRS422_RX1_N (in), OUT_BRS422_RX1_P (in), OUT_BRS422_RX2_N (in), OUT_BRS422_RX2_P (in), OUT_BRS422_RX3_N (in), OUT_BRS422_RX3_P (in), OUT_BRS422_RX4_N (in), OUT_BRS422_RX4_P (in), OUT_BRS422_RX5_N (in), OUT_BRS422_RX5_P (in), OUT_BRS422_RX6_N (in), OUT_BRS422_RX6_P (in), OUT_BRS422_RX7_N (in), OUT_BRS422_RX7_P (in)

### Nets
+3V3: C63.1 C64.1 C65.1 C66.1 U10.4(EN) U10.12(~{EN}) U10.16(VCC) U11.4(EN) U11.12(~{EN}) U11.16(VCC)
GND: C63.2 C64.2 C65.2 C66.2 U10.8(GND) U11.8(GND)
BRS422_RX0_N: R19.1 U10.1(INA-) ; port OUT_BRS422_RX0_N
BRS422_RX0_P: R19.2 U10.2(INA+) ; port OUT_BRS422_RX0_P
BRS422_RX1_N: R20.1 U10.7(INB-) ; port OUT_BRS422_RX1_N
BRS422_RX1_P: R20.2 U10.6(INB+) ; port OUT_BRS422_RX1_P
BRS422_RX2_N: R82.1 U10.9(INC-) ; port OUT_BRS422_RX2_N
BRS422_RX2_P: R82.2 U10.10(INC+) ; port OUT_BRS422_RX2_P
BRS422_RX3_N: R83.1 U10.15(IND-) ; port OUT_BRS422_RX3_N
BRS422_RX3_P: R83.2 U10.14(IND+) ; port OUT_BRS422_RX3_P
BRS422_RX4_N: R84.1 U11.1(INA-) ; port OUT_BRS422_RX4_N
BRS422_RX4_P: R84.2 U11.2(INA+) ; port OUT_BRS422_RX4_P
BRS422_RX5_N: R85.1 U11.7(INB-) ; port OUT_BRS422_RX5_N
BRS422_RX5_P: R85.2 U11.6(INB+) ; port OUT_BRS422_RX5_P
BRS422_RX6_N: R86.1 U11.9(INC-) ; port OUT_BRS422_RX6_N
BRS422_RX6_P: R86.2 U11.10(INC+) ; port OUT_BRS422_RX6_P
BRS422_RX7_N: R87.1 U11.15(IND-) ; port OUT_BRS422_RX7_N
BRS422_RX7_P: R87.2 U11.14(IND+) ; port OUT_BRS422_RX7_P
FPGA_BRS422_RX0: U10.3(OUTA) ; port FPGA_BRS422_RX0
FPGA_BRS422_RX1: U10.5(OUTB) ; port FPGA_BRS422_RX1
FPGA_BRS422_RX2: U10.11(OUTC) ; port FPGA_BRS422_RX2
FPGA_BRS422_RX3: U10.13(OUTD) ; port FPGA_BRS422_RX3
FPGA_BRS422_RX4: U11.3(OUTA) ; port FPGA_BRS422_RX4
FPGA_BRS422_RX5: U11.5(OUTB) ; port FPGA_BRS422_RX5
FPGA_BRS422_RX6: U11.11(OUTC) ; port FPGA_BRS422_RX6
FPGA_BRS422_RX7: U11.13(OUTD) ; port FPGA_BRS422_RX7

### Layout directives
differential pair: BRS422_RX0_N, BRS422_RX0_P, BRS422_RX1_N, BRS422_RX1_P, BRS422_RX2_N, BRS422_RX2_P, BRS422_RX3_N, BRS422_RX3_P, BRS422_RX4_N, BRS422_RX4_P, BRS422_RX5_N, BRS422_RX5_P, BRS422_RX6_N, BRS422_RX6_P, BRS422_RX7_N, BRS422_RX7_P

### Library data of the parts
U10 U11 = DS34LV86TMX/NOPB: Supplier 1: Digi-Key; Supplier Part Number 1: 296-13065-1-ND

## Sheet InterfacesB_RGMII_Ethernet.SchDoc
size A4; DocumentNumber: 8; SheetNumber: 8
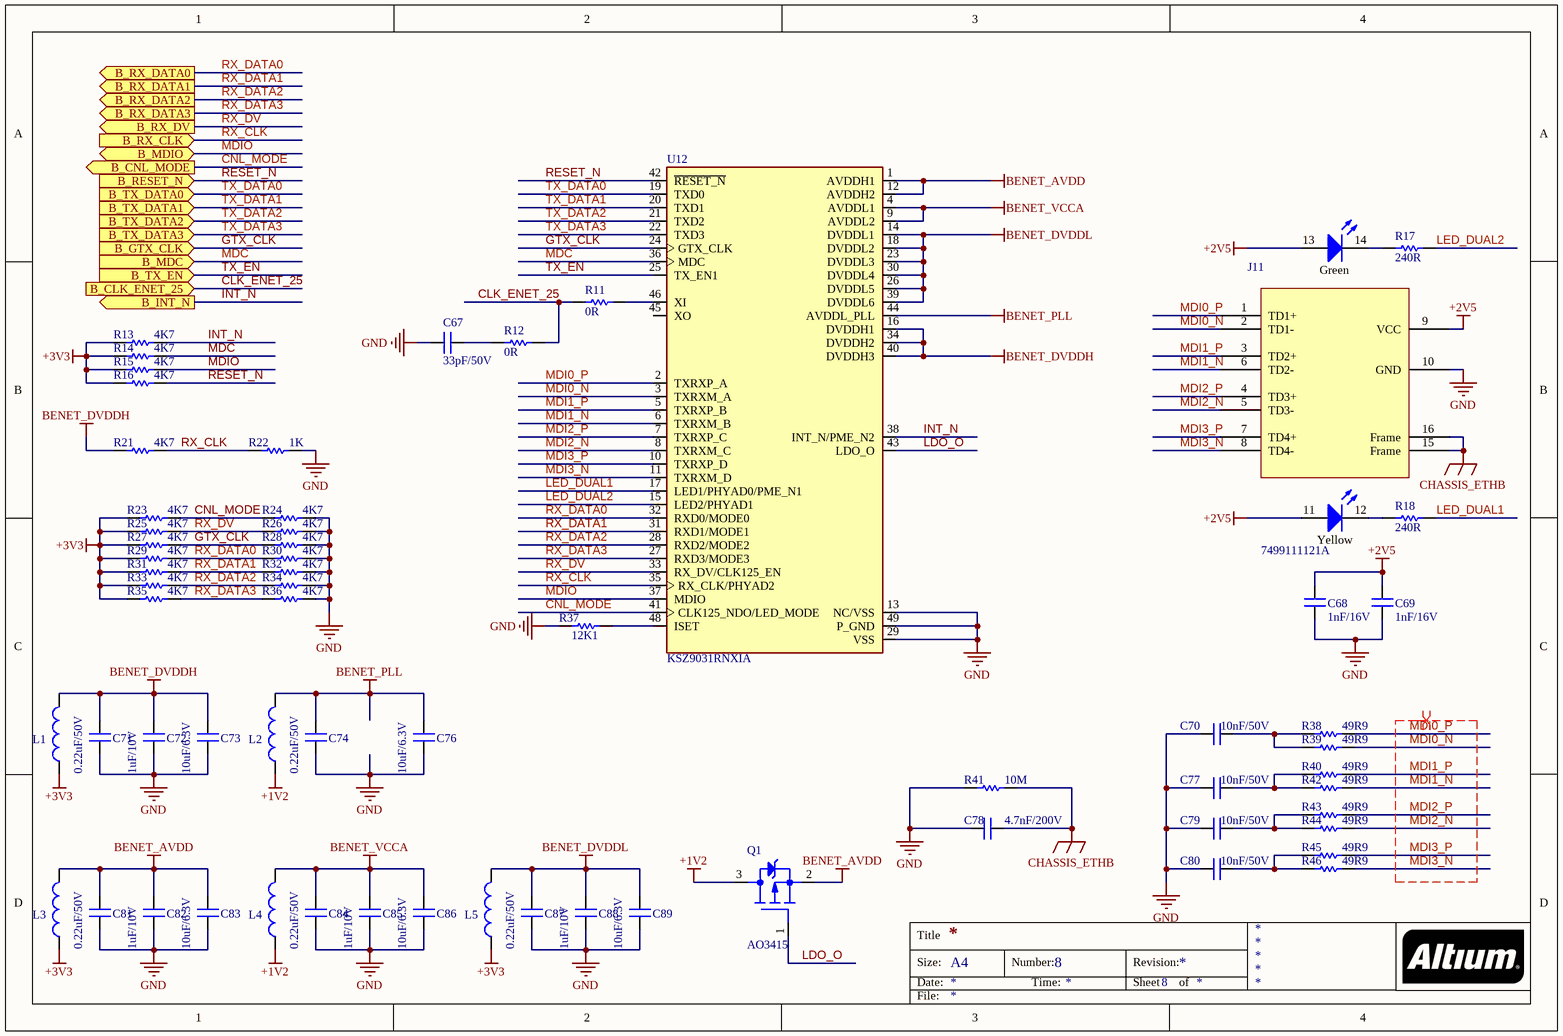
[diagram p7: InterfacesB_RGMII_Ethernet.SchDoc]

### Parts
C67  value 33pF/50V  [CAP_0805]  (hidden comment: CAP_0805)
C68  value 1nF/16V  [CAP_0805]  (hidden comment: CAP_0805)
C69  value 1nF/16V  [CAP_0805]  (hidden comment: CAP_0805)
C70  value 10nF/50V  [CAP_0805]  (hidden comment: CAP_0805)
C71  value 0.22uF/50V  [CAP_0805]  (hidden comment: CAP_0805)
C72  value 1uF/10V  [CAP_0805]  (hidden comment: CAP_0805)
C73  value 10uF/6.3V  [CAP_0805]  (hidden comment: CAP_0805)
C74  value 0.22uF/50V  [CAP_0805]  (hidden comment: CAP_0805)
C76  value 10uF/6.3V  [CAP_0805]  (hidden comment: CAP_0805)
C77  value 10nF/50V  [CAP_0805]  (hidden comment: CAP_0805)
C78  value 4.7nF/200V  [CAP_0805]  (hidden comment: CAP_0805)
C79  value 10nF/50V  [CAP_0805]  (hidden comment: CAP_0805)
C80  value 10nF/50V  [CAP_0805]  (hidden comment: CAP_0805)
C81  value 0.22uF/50V  [CAP_0805]  (hidden comment: CAP_0805)
C82  value 1uF/10V  [CAP_0805]  (hidden comment: CAP_0805)
C83  value 10uF/6.3V  [CAP_0805]  (hidden comment: CAP_0805)
C84  value 0.22uF/50V  [CAP_0805]  (hidden comment: CAP_0805)
C85  value 1uF/10V  [CAP_0805]  (hidden comment: CAP_0805)
C86  value 10uF/6.3V  [CAP_0805]  (hidden comment: CAP_0805)
C87  value 0.22uF/50V  [CAP_0805]  (hidden comment: CAP_0805)
C88  value 1uF/10V  [CAP_0805]  (hidden comment: CAP_0805)
C89  value 10uF/6.3V  [CAP_0805]  (hidden comment: CAP_0805)
J11  7499111121A  [7499111121A]
L1  IND_0805  [IND_0805]  (value not drawn)
L2  IND_0805  [IND_0805]  (value not drawn)
L3  IND_0805  [IND_0805]  (value not drawn)
L4  IND_0805  [IND_0805]  (value not drawn)
L5  IND_0805  [IND_0805]  (value not drawn)
Q1  AO3415  [AO3415]
R11  value 0R  [RES_0805]  (hidden comment: RES_0805)
R12  value 0R  [RES_0805]  (hidden comment: RES_0805)
R13  value 4K7  [RES_0805]  (hidden comment: RES_0805)
R14  value 4K7  [RES_0805]  (hidden comment: RES_0805)
R15  value 4K7  [RES_0805]  (hidden comment: RES_0805)
R16  value 4K7  [RES_0805]  (hidden comment: RES_0805)
R17  value 240R  [RES_0805]  (hidden comment: RES_0805)
R18  value 240R  [RES_0805]  (hidden comment: RES_0805)
R21  value 4K7  [RES_0805]  (hidden comment: RES_0805)
R22  value 1K  [RES_0805]  (hidden comment: RES_0805)
R23  value 4K7  [RES_0805]  (hidden comment: RES_0805)
R24  value 4K7  [RES_0805]  (hidden comment: RES_0805)
R25  value 4K7  [RES_0805]  (hidden comment: RES_0805)
R26  value 4K7  [RES_0805]  (hidden comment: RES_0805)
R27  value 4K7  [RES_0805]  (hidden comment: RES_0805)
R28  value 4K7  [RES_0805]  (hidden comment: RES_0805)
R29  value 4K7  [RES_0805]  (hidden comment: RES_0805)
R30  value 4K7  [RES_0805]  (hidden comment: RES_0805)
R31  value 4K7  [RES_0805]  (hidden comment: RES_0805)
R32  value 4K7  [RES_0805]  (hidden comment: RES_0805)
R33  value 4K7  [RES_0805]  (hidden comment: RES_0805)
R34  value 4K7  [RES_0805]  (hidden comment: RES_0805)
R35  value 4K7  [RES_0805]  (hidden comment: RES_0805)
R36  value 4K7  [RES_0805]  (hidden comment: RES_0805)
R37  value 12K1  [RES_0805]  (hidden comment: RES_0805)
R38  value 49R9  [RES_0805]  (hidden comment: RES_0805)
R39  value 49R9  [RES_0805]  (hidden comment: RES_0805)
R40  value 49R9  [RES_0805]  (hidden comment: RES_0805)
R41  value 10M  [RES_0805]  (hidden comment: RES_0805)
R42  value 49R9  [RES_0805]  (hidden comment: RES_0805)
R43  value 49R9  [RES_0805]  (hidden comment: RES_0805)
R44  value 49R9  [RES_0805]  (hidden comment: RES_0805)
R45  value 49R9  [RES_0805]  (hidden comment: RES_0805)
R46  value 49R9  [RES_0805]  (hidden comment: RES_0805)
U12  KSZ9031RNXIA  [KSZ9031RNXIA]

### Ports
B_CLK_ENET_25 (in), B_CNL_MODE (out), B_GTX_CLK (in), B_INT_N (out), B_MDC (in), B_MDIO (bidir), B_RESET_N (in), B_RX_CLK (in), B_RX_DATA0 (out), B_RX_DATA1 (out), B_RX_DATA2 (out), B_RX_DATA3 (out), B_RX_DV (out), B_TX_DATA0 (in), B_TX_DATA1 (in), B_TX_DATA2 (in), B_TX_DATA3 (in), B_TX_EN (in)

### Nets
+1V2: L2.1 L4.1 Q1.3(D)
+2V5: C68.2 C69.2 J11.9(VCC) J11.11(A) J11.13(A)
+3V3: L1.1 L3.1 L5.1 R13.2 R14.2 R15.2 R16.2 R23.2 R25.2 R27.2 R29.2 R31.2 R33.2 R35.2
BENET_AVDD: C81.2 C82.2 C83.2 L3.2 Q1.2(S) U12.1(AVDDH1) U12.12(AVDDH2)
BENET_DVDDH: C71.2 C72.2 C73.2 L1.2 R21.2 U12.16(DVDDH1) U12.34(DVDDH2) U12.40(DVDDH3)
BENET_DVDDL: C87.2 C88.2 C89.2 L5.2 U12.14(DVDDL1) U12.18(DVDDL2) U12.23(DVDDL3) U12.26(DVDDL5) U12.30(DVDDL4) U12.39(DVDDL6)
BENET_PLL: C74.2 C76.2 L2.2 U12.44(AVDDL_PLL)
BENET_VCCA: C84.2 C85.2 C86.2 L4.2 U12.4(AVDDL1) U12.9(AVDDL2)
CHASSIS_ETHB: C78.1 J11.15(Frame) J11.16(Frame) R41.1
GND: C67.2 C68.1 C69.1 C70.2 C71.1 C72.1 C73.1 C74.1 C76.1 C77.2 C78.2 C79.2 C80.2 C81.1 C82.1 C83.1 C84.1 C85.1 C86.1 C87.1 C88.1 C89.1 J11.10(GND) R22.1 R24.1 R26.1 R28.1 R30.1 R32.1 R34.1 R36.1 R37.1 R41.2 U12.13(NC/VSS) U12.29(VSS) U12.49(P_GND)
CLK_ENET_25: R11.2 R12.2 ; port B_CLK_ENET_25
CNL_MODE: R23.1 R24.2 U12.41(CLK125_NDO/LED_MODE) ; port B_CNL_MODE
GTX_CLK: R27.1 R28.2 U12.24(GTX_CLK) ; port B_GTX_CLK
INT_N: R13.1 U12.38(INT_N/PME_N2) ; port B_INT_N
LDO_O: Q1.1(G) U12.43(LDO_O)
LED_DUAL1: R18.2 U12.17(LED1/PHYAD0/PME_N1)
LED_DUAL2: R17.2 U12.15(LED2/PHYAD1)
MDC: R14.1 U12.36(MDC) ; port B_MDC
MDI0_N: J11.2(TD1-) R39.2 U12.3(TXRXM_A)
MDI0_P: J11.1(TD1+) R38.2 U12.2(TXRXP_A)
MDI1_N: J11.6(TD2-) R42.2 U12.6(TXRXM_B)
MDI1_P: J11.3(TD2+) R40.2 U12.5(TXRXP_B)
MDI2_N: J11.5(TD3-) R44.2 U12.8(TXRXM_C)
MDI2_P: J11.4(TD3+) R43.2 U12.7(TXRXP_C)
MDI3_N: J11.8(TD4-) R46.2 U12.11(TXRXM_D)
MDI3_P: J11.7(TD4+) R45.2 U12.10(TXRXP_D)
MDIO: R15.1 U12.37(MDIO) ; port B_MDIO
RESET_N: R16.1 U12.42(~{RESET_N}) ; port B_RESET_N
RX_CLK: R21.1 R22.2 U12.35(RX_CLK/PHYAD2) ; port B_RX_CLK
RX_DATA0: R29.1 R30.2 U12.32(RXD0/MODE0) ; port B_RX_DATA0
RX_DATA1: R31.1 R32.2 U12.31(RXD1/MODE1) ; port B_RX_DATA1
RX_DATA2: R33.1 R34.2 U12.28(RXD2/MODE2) ; port B_RX_DATA2
RX_DATA3: R35.1 R36.2 U12.27(RXD3/MODE3) ; port B_RX_DATA3
RX_DV: R25.1 R26.2 U12.33(RX_DV/CLK125_EN) ; port B_RX_DV
TX_DATA0: U12.19(TXD0) ; port B_TX_DATA0
TX_DATA1: U12.20(TXD1) ; port B_TX_DATA1
TX_DATA2: U12.21(TXD2) ; port B_TX_DATA2
TX_DATA3: U12.22(TXD3) ; port B_TX_DATA3
TX_EN: U12.25(TX_EN1) ; port B_TX_EN
NetC67_1: C67.1 R12.1
NetC70_1: C70.1 R38.1 R39.1
NetC77_1: C77.1 R40.1 R42.1
NetC79_1: C79.1 R43.1 R44.1
NetC80_1: C80.1 R45.1 R46.1
NetJ11_12: J11.12(K) R18.1
NetJ11_14: J11.14(K) R17.1
NetR11_1: R11.1 U12.46(XI)
NetR37_2: R37.2 U12.48(ISET)

Not connected (* = marked no-connect by the designer): U12 45(XO)

### Layout directives
differential pair: MDI0_N, MDI0_P, MDI1_N, MDI1_P, MDI2_N, MDI2_P, MDI3_N, MDI3_P

### Notes on the sheet
- Title
- Size:
- Date:
- A4
- Number:
- Time:
- Revision:
- Sheet
- of
- File:
- (in symbol 7499111121A) Green; Yellow

### Library data of the parts
Q1 = AO3415: 20V P-Channel MOSFET
U12 = KSZ9031RNXIA: 4/4 Transceiver Full Ethernet 48-QFN _7x7_; MF: Microchip; MP: KSZ9031RNXIA; Digi-Key_Purchase_URL: https://www.digikey.pk/product-detail/en/microchip-technology/KSZ9031RNXIA-TR/KSZ9031RNXIA-TR-ND/3925129?utm_source=snapeda&utm_medium=aggregator&utm_campaign=symbol; Package: QFN-48 Microchip; SnapEDA_Link: https://www.snapeda.com/parts/KSZ9031RNXIA/Microchip/view-part/378526/?ref=snap; Value: *; Digi-Key_Part_Number: KSZ9031RNXIA-TR-ND
J11 = 7499111121A: Supplier 1: Digi-Key; Supplier Part Number 1: 1297-1070-5-ND

## Sheet InterfacesA_USBFTDI.SchDoc
size A4; DocumentNumber: 9; SheetNumber: 9
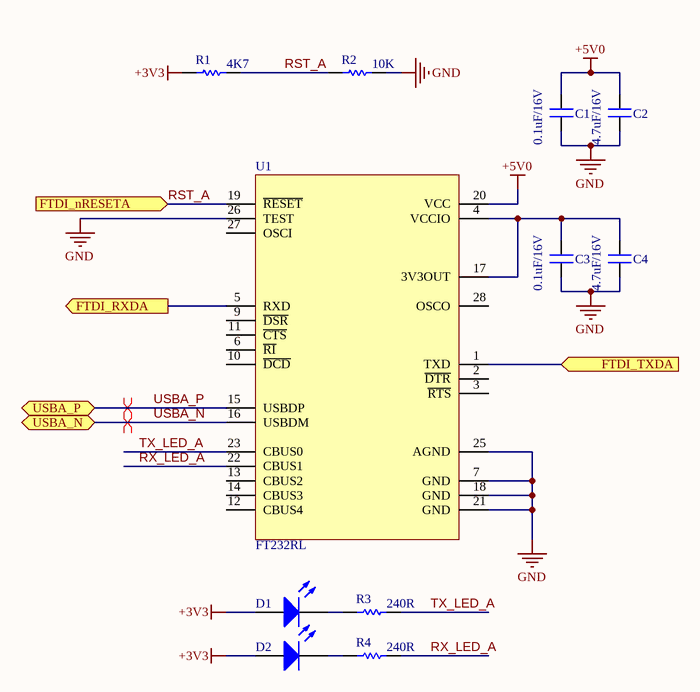
[diagram p8: InterfacesA_USBFTDI.SchDoc]

### Parts
C1  value 0.1uF/16V  [CAP_0805]  (hidden comment: CAP_0805)
C2  value 4.7uF/16V  [CAP_0805]  (hidden comment: CAP_0805)
C3  value 0.1uF/16V  [CAP_0805]  (hidden comment: CAP_0805)
C4  value 4.7uF/16V  [CAP_0805]  (hidden comment: CAP_0805)
D1  LED_0603  [LED_0603]  (value not drawn)
D2  LED_0603  [LED_0603]  (value not drawn)
R1  value 4K7  [RES_0805]  (hidden comment: RES_0805)
R2  value 10K  [RES_0805]  (hidden comment: RES_0805)
R3  value 240R  [RES_0805]  (hidden comment: RES_0805)
R4  value 240R  [RES_0805]  (hidden comment: RES_0805)
U1  FT232RL  [FT232RL]

### Ports
FTDI_nRESETA (in), FTDI_RXDA (out), FTDI_TXDA (in), USBA_N (bidir), USBA_P (bidir)

### Nets
+3V3: D1.1(A) D2.1(A) R1.1
+5V0: C1.1 C2.2 U1.20(VCC)
GND: C1.2 C2.1 C3.2 C4.1 R2.2 U1.7(GND) U1.18(GND) U1.21(GND) U1.25(AGND) U1.26(TEST)
FTDI_RXDA: U1.5(RXD) ; port FTDI_RXDA
FTDI_TXDA: U1.1(TXD) ; port FTDI_TXDA
RST_A: R1.2 R2.1 U1.19(~{RESET}) ; port FTDI_nRESETA
RX_LED_A: R4.2 U1.22(CBUS1)
TX_LED_A: R3.2 U1.23(CBUS0)
USBA_N: U1.16(USBDM) ; port USBA_N
USBA_P: U1.15(USBDP) ; port USBA_P
NetC3_1: C3.1 C4.2 U1.4(VCCIO) U1.17(3V3OUT)
NetD1_2: D1.2(K) R3.1
NetD2_2: D2.2(K) R4.1

Not connected (* = marked no-connect by the designer): U1 2(~{DTR}) 3(~{RTS}) 6(~{RI}) 9(~{DSR}) 10(~{DCD}) 11(~{CTS}) 12(CBUS4) 13(CBUS2) 14(CBUS3) 27(OSCI) 28(OSCO)

### Layout directives
differential pair: USBA_N, USBA_P

### Notes on the sheet
- Title
- Size:
- Date:
- A4
- Number:
- Time:
- Revision:
- Sheet
- of
- File:

### Library data of the parts
U1 = FT232RL: USB Bridge, USB to UART USB 2.0 UART Interface 28-SSOP; MP: FT232RL-REEL; MF: FTDI,; Digi-Key_Purchase_URL: https://www.digikey.com/product-detail/en/ftdi-future-technology-devices-international-ltd/FT232RL-REEL/768-1007-1-ND/1836402?utm_source=snapeda&utm_medium=aggregator&utm_campaign=symbol; Digi-Key_Part_Number: 768-1007-1-ND; Package: SSOP-28 FTDI; Value: *; SnapEDA_Link: https://www.snapeda.com/parts/FT232RL-REEL/FTDI%2C%20Future%20Technology%20Devices%20International%20Ltd/view-part/45427/?ref=snap

## Sheet InterfacesB_SHIFTER_LEDS.SchDoc
size A; DocumentNumber: 10; SheetNumber: 10
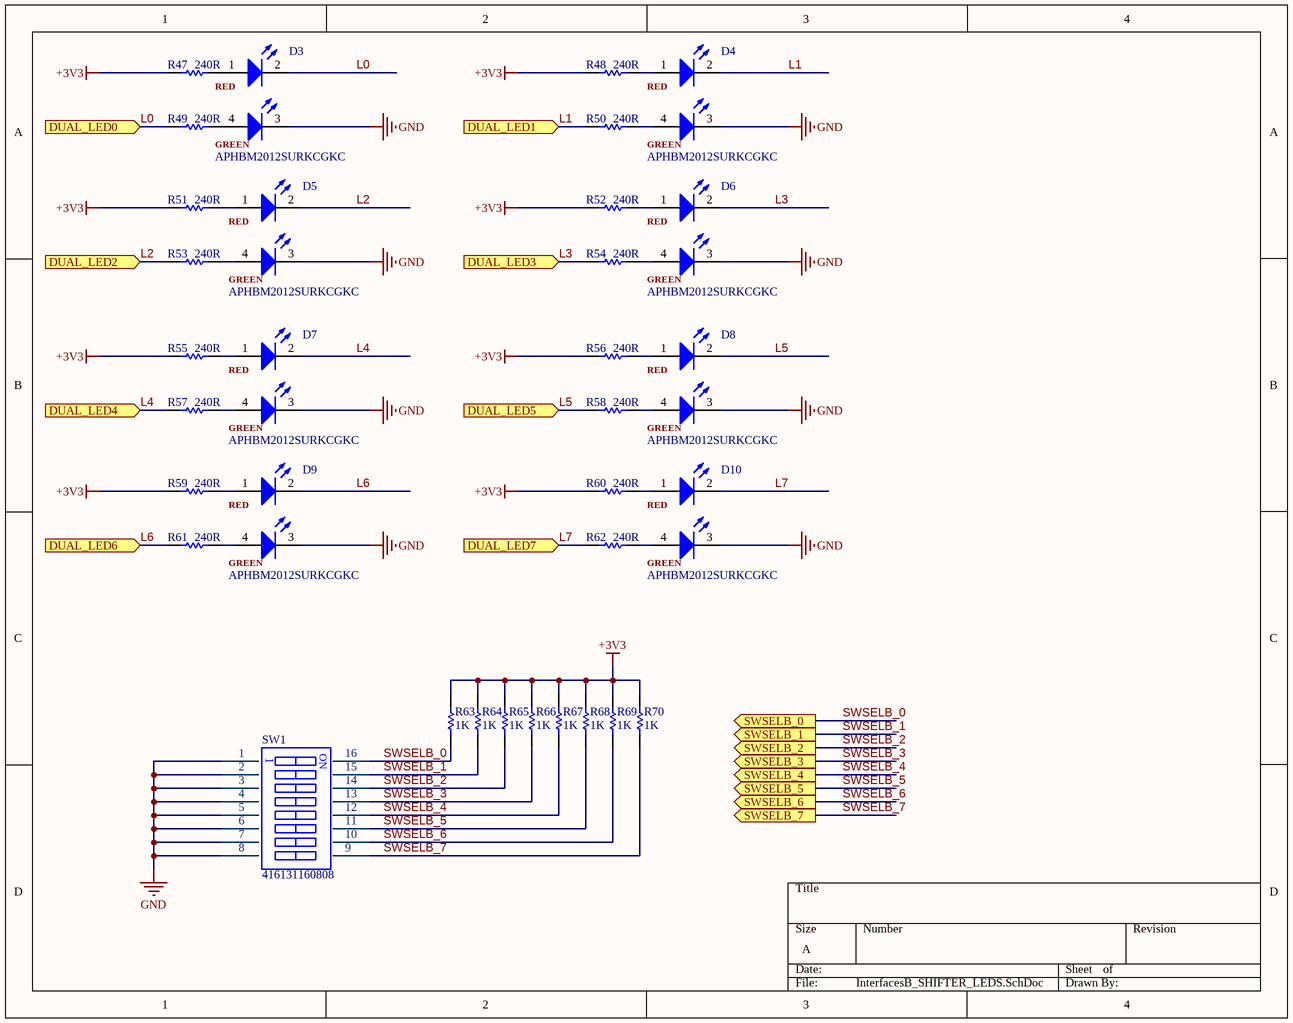
[diagram p9: InterfacesB_SHIFTER_LEDS.SchDoc]

### Parts
D3  APHBM2012SURKCGKC  [APHBM2012SURKCGKC]
D4  APHBM2012SURKCGKC  [APHBM2012SURKCGKC]
D5  APHBM2012SURKCGKC  [APHBM2012SURKCGKC]
D6  APHBM2012SURKCGKC  [APHBM2012SURKCGKC]
D7  APHBM2012SURKCGKC  [APHBM2012SURKCGKC]
D8  APHBM2012SURKCGKC  [APHBM2012SURKCGKC]
D9  APHBM2012SURKCGKC  [APHBM2012SURKCGKC]
D10  APHBM2012SURKCGKC  [APHBM2012SURKCGKC]
R47  value 240R  [RES_0805]  (hidden comment: RES_0805)
R48  value 240R  [RES_0805]  (hidden comment: RES_0805)
R49  value 240R  [RES_0805]  (hidden comment: RES_0805)
R50  value 240R  [RES_0805]  (hidden comment: RES_0805)
R51  value 240R  [RES_0805]  (hidden comment: RES_0805)
R52  value 240R  [RES_0805]  (hidden comment: RES_0805)
R53  value 240R  [RES_0805]  (hidden comment: RES_0805)
R54  value 240R  [RES_0805]  (hidden comment: RES_0805)
R55  value 240R  [RES_0805]  (hidden comment: RES_0805)
R56  value 240R  [RES_0805]  (hidden comment: RES_0805)
R57  value 240R  [RES_0805]  (hidden comment: RES_0805)
R58  value 240R  [RES_0805]  (hidden comment: RES_0805)
R59  value 240R  [RES_0805]  (hidden comment: RES_0805)
R60  value 240R  [RES_0805]  (hidden comment: RES_0805)
R61  value 240R  [RES_0805]  (hidden comment: RES_0805)
R62  value 240R  [RES_0805]  (hidden comment: RES_0805)
R63  value 1K  [RES_0805]  (hidden comment: RES_0805)
R64  value 1K  [RES_0805]  (hidden comment: RES_0805)
R65  value 1K  [RES_0805]  (hidden comment: RES_0805)
R66  value 1K  [RES_0805]  (hidden comment: RES_0805)
R67  value 1K  [RES_0805]  (hidden comment: RES_0805)
R68  value 1K  [RES_0805]  (hidden comment: RES_0805)
R69  value 1K  [RES_0805]  (hidden comment: RES_0805)
R70  value 1K  [RES_0805]  (hidden comment: RES_0805)
SW1  416131160808  [416131160808]

### Ports
DUAL_LED0 (in), DUAL_LED1 (in), DUAL_LED2 (in), DUAL_LED3 (in), DUAL_LED4 (in), DUAL_LED5 (in), DUAL_LED6 (in), DUAL_LED7 (in), SWSELB_0 (out), SWSELB_1 (out), SWSELB_2 (out), SWSELB_3 (out), SWSELB_4 (out), SWSELB_5 (out), SWSELB_6 (out), SWSELB_7 (out)

### Nets
+3V3: R47.2 R48.2 R51.2 R52.2 R55.2 R56.2 R59.2 R60.2 R63.2 R64.2 R65.2 R66.2 R67.2 R68.2 R69.2 R70.2
GND: D3.3 D4.3 D5.3 D6.3 D7.3 D8.3 D9.3 D10.3 SW1.1 SW1.2 SW1.3 SW1.4 SW1.5 SW1.6 SW1.7 SW1.8
L0: D3.2 R49.2 ; port DUAL_LED0
L1: D4.2 R50.2 ; port DUAL_LED1
L2: D5.2 R53.2 ; port DUAL_LED2
L3: D6.2 R54.2 ; port DUAL_LED3
L4: D7.2 R57.2 ; port DUAL_LED4
L5: D8.2 R58.2 ; port DUAL_LED5
L6: D9.2 R61.2 ; port DUAL_LED6
L7: D10.2 R62.2 ; port DUAL_LED7
SWSELB_0: R63.1 SW1.16 ; port SWSELB_0
SWSELB_1: R64.1 SW1.15 ; port SWSELB_1
SWSELB_2: R65.1 SW1.14 ; port SWSELB_2
SWSELB_3: R66.1 SW1.13 ; port SWSELB_3
SWSELB_4: R67.1 SW1.12 ; port SWSELB_4
SWSELB_5: R68.1 SW1.11 ; port SWSELB_5
SWSELB_6: R69.1 SW1.10 ; port SWSELB_6
SWSELB_7: R70.1 SW1.9 ; port SWSELB_7
NetD3_1: D3.1 R47.1
NetD3_4: D3.4 R49.1
NetD4_1: D4.1 R48.1
NetD4_4: D4.4 R50.1
NetD5_1: D5.1 R51.1
NetD5_4: D5.4 R53.1
NetD6_1: D6.1 R52.1
NetD6_4: D6.4 R54.1
NetD7_1: D7.1 R55.1
NetD7_4: D7.4 R57.1
NetD8_1: D8.1 R56.1
NetD8_4: D8.4 R58.1
NetD9_1: D9.1 R59.1
NetD9_4: D9.4 R61.1
NetD10_1: D10.1 R60.1
NetD10_4: D10.4 R62.1

### Notes on the sheet
- (in symbol 416131160808) ON
- (in symbol APHBM2012SURKCGKC) RED; GREEN

### Library data of the parts
SW1 = 416131160808: 8 POS DIP SW SMD
D3-D10 = APHBM2012SURKCGKC: Supplier 1: Digi-Key; Supplier Part Number 1: 754-1093-1-ND

## Sheet InterfacesB_CONNECTORS.SchDoc
size A; DocumentNumber: 11; SheetNumber: 11
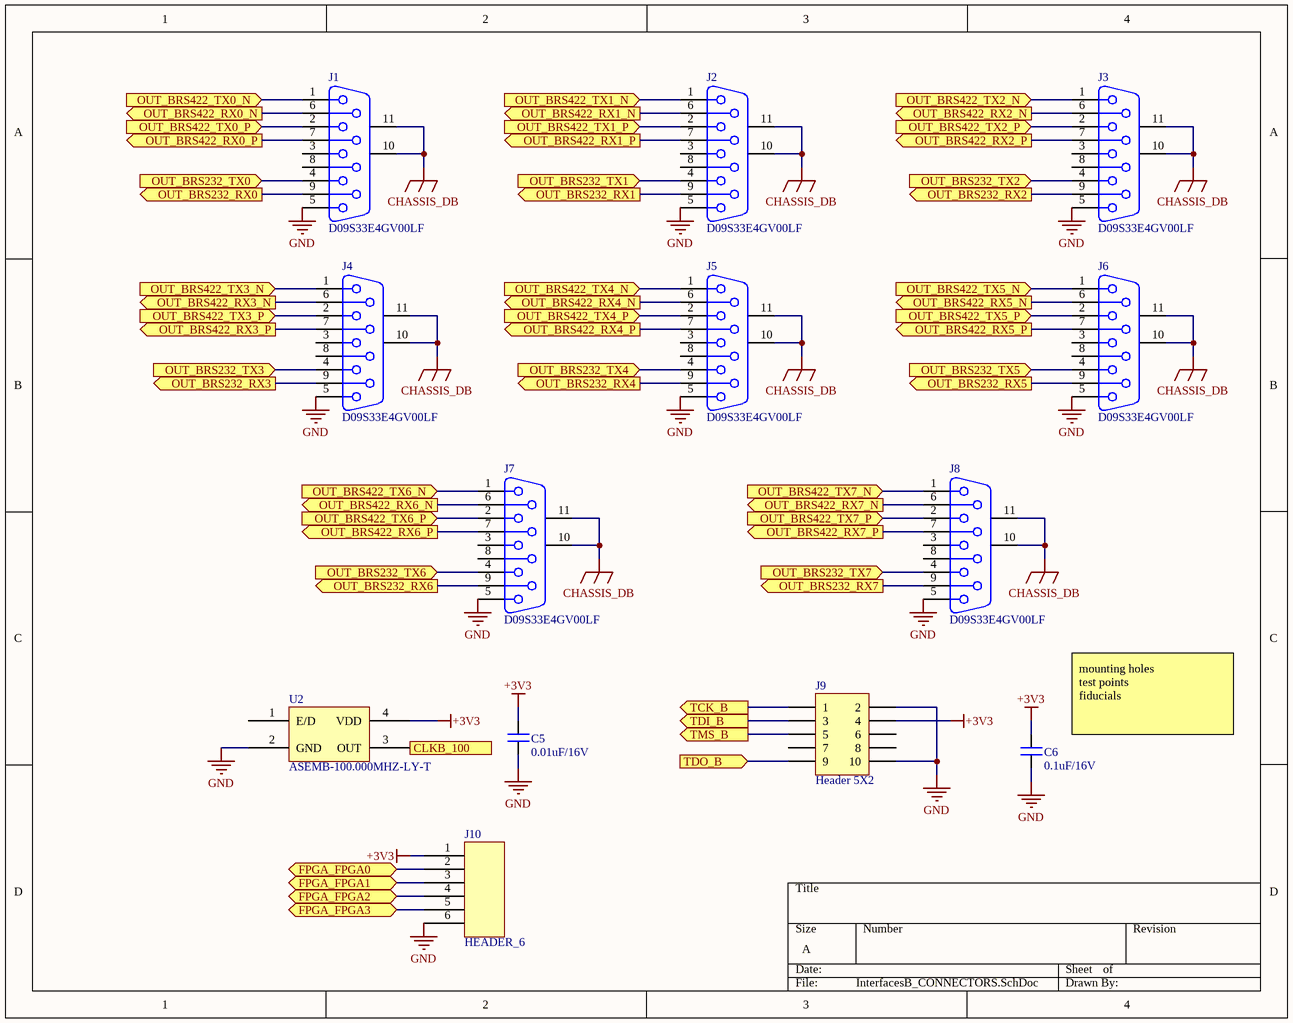
[diagram p10: InterfacesB_CONNECTORS.SchDoc]

### Parts
C5  value 0.01uF/16V  [CAP_0805]  (hidden comment: CAP_0805)
C6  value 0.1uF/16V  [CAP_0805]  (hidden comment: CAP_0805)
J1  D09S33E4GV00LF  [D09S33E4GV00LF]
J2  D09S33E4GV00LF  [D09S33E4GV00LF]
J3  D09S33E4GV00LF  [D09S33E4GV00LF]
J4  D09S33E4GV00LF  [D09S33E4GV00LF]
J5  D09S33E4GV00LF  [D09S33E4GV00LF]
J6  D09S33E4GV00LF  [D09S33E4GV00LF]
J7  D09S33E4GV00LF  [D09S33E4GV00LF]
J8  D09S33E4GV00LF  [D09S33E4GV00LF]
J9  Header 5X2  [HEADER 5x2]
J10  HEADER_6  [HEADER_6]
U2  ASEMB-100.000MHZ-LY-T  [ASEMB-100.000MHZ-LY-T]

### Ports
CLKB_100 (out), FPGA_FPGA0 (bidir), FPGA_FPGA1 (bidir), FPGA_FPGA2 (bidir), FPGA_FPGA3 (bidir), OUT_BRS232_RX0 (out), OUT_BRS232_RX1 (out), OUT_BRS232_RX2 (out), OUT_BRS232_RX3 (out), OUT_BRS232_RX4 (out), OUT_BRS232_RX5 (out), OUT_BRS232_RX6 (out), OUT_BRS232_RX7 (out), OUT_BRS232_TX0 (in), OUT_BRS232_TX1 (in), OUT_BRS232_TX2 (in), OUT_BRS232_TX3 (in), OUT_BRS232_TX4 (in), OUT_BRS232_TX5 (in), OUT_BRS232_TX6 (in), OUT_BRS232_TX7 (in), OUT_BRS422_RX0_N (out), OUT_BRS422_RX0_P (out), OUT_BRS422_RX1_N (out), OUT_BRS422_RX1_P (out), OUT_BRS422_RX2_N (out), OUT_BRS422_RX2_P (out), OUT_BRS422_RX3_N (out), OUT_BRS422_RX3_P (out), OUT_BRS422_RX4_N (out), OUT_BRS422_RX4_P (out), OUT_BRS422_RX5_N (out), OUT_BRS422_RX5_P (out), OUT_BRS422_RX6_N (out), OUT_BRS422_RX6_P (out), OUT_BRS422_RX7_N (out), OUT_BRS422_RX7_P (out), OUT_BRS422_TX0_N (in), OUT_BRS422_TX0_P (in), OUT_BRS422_TX1_N (in), OUT_BRS422_TX1_P (in), OUT_BRS422_TX2_N (in), OUT_BRS422_TX2_P (in), OUT_BRS422_TX3_N (in), OUT_BRS422_TX3_P (in), OUT_BRS422_TX4_N (in), OUT_BRS422_TX4_P (in), OUT_BRS422_TX5_N (in), OUT_BRS422_TX5_P (in), OUT_BRS422_TX6_N (in), OUT_BRS422_TX6_P (in), OUT_BRS422_TX7_N (in), OUT_BRS422_TX7_P (in), TCK_B (out), TDI_B (out), TDO_B (in), TMS_B (out)

### Nets
+3V3: C5.2 C6.2 J9.4 J10.1 U2.4(VDD)
CHASSIS_DB: J1.10(MH1) J1.11(MH2) J2.10(MH1) J2.11(MH2) J3.10(MH1) J3.11(MH2) J4.10(MH1) J4.11(MH2) J5.10(MH1) J5.11(MH2) J6.10(MH1) J6.11(MH2) J7.10(MH1) J7.11(MH2) J8.10(MH1) J8.11(MH2)
GND: C5.1 C6.1 J1.5 J2.5 J3.5 J4.5 J5.5 J6.5 J7.5 J8.5 J9.2 J9.10 J10.6 U2.2(GND)
BRS422_RX0_N: J1.6 ; port OUT_BRS422_RX0_N
BRS422_RX0_P: J1.7 ; port OUT_BRS422_RX0_P
BRS422_RX1_N: J2.6 ; port OUT_BRS422_RX1_N
BRS422_RX1_P: J2.7 ; port OUT_BRS422_RX1_P
BRS422_RX2_N: J3.6 ; port OUT_BRS422_RX2_N
BRS422_RX2_P: J3.7 ; port OUT_BRS422_RX2_P
BRS422_RX3_N: J4.6 ; port OUT_BRS422_RX3_N
BRS422_RX3_P: J4.7 ; port OUT_BRS422_RX3_P
BRS422_RX4_N: J5.6 ; port OUT_BRS422_RX4_N
BRS422_RX4_P: J5.7 ; port OUT_BRS422_RX4_P
BRS422_RX5_N: J6.6 ; port OUT_BRS422_RX5_N
BRS422_RX5_P: J6.7 ; port OUT_BRS422_RX5_P
BRS422_RX6_N: J7.6 ; port OUT_BRS422_RX6_N
BRS422_RX6_P: J7.7 ; port OUT_BRS422_RX6_P
BRS422_RX7_N: J8.6 ; port OUT_BRS422_RX7_N
BRS422_RX7_P: J8.7 ; port OUT_BRS422_RX7_P
BRS422_TX0_N: J1.1 ; port OUT_BRS422_TX0_N
BRS422_TX0_P: J1.2 ; port OUT_BRS422_TX0_P
BRS422_TX1_N: J2.1 ; port OUT_BRS422_TX1_N
BRS422_TX1_P: J2.2 ; port OUT_BRS422_TX1_P
BRS422_TX2_N: J3.1 ; port OUT_BRS422_TX2_N
BRS422_TX2_P: J3.2 ; port OUT_BRS422_TX2_P
BRS422_TX3_N: J4.1 ; port OUT_BRS422_TX3_N
BRS422_TX3_P: J4.2 ; port OUT_BRS422_TX3_P
BRS422_TX4_N: J5.1 ; port OUT_BRS422_TX4_N
BRS422_TX4_P: J5.2 ; port OUT_BRS422_TX4_P
BRS422_TX5_N: J6.1 ; port OUT_BRS422_TX5_N
BRS422_TX5_P: J6.2 ; port OUT_BRS422_TX5_P
BRS422_TX6_N: J7.1 ; port OUT_BRS422_TX6_N
BRS422_TX6_P: J7.2 ; port OUT_BRS422_TX6_P
BRS422_TX7_N: J8.1 ; port OUT_BRS422_TX7_N
BRS422_TX7_P: J8.2 ; port OUT_BRS422_TX7_P
CLKB_100: U2.3(OUT) ; port CLKB_100
FPGA_FPGA0: J10.2 ; port FPGA_FPGA0
FPGA_FPGA1: J10.3 ; port FPGA_FPGA1
FPGA_FPGA2: J10.4 ; port FPGA_FPGA2
FPGA_FPGA3: J10.5 ; port FPGA_FPGA3
OUT_BRS232_RX0: J1.9 ; port OUT_BRS232_RX0
OUT_BRS232_RX1: J2.9 ; port OUT_BRS232_RX1
OUT_BRS232_RX2: J3.9 ; port OUT_BRS232_RX2
OUT_BRS232_RX3: J4.9 ; port OUT_BRS232_RX3
OUT_BRS232_RX4: J5.9 ; port OUT_BRS232_RX4
OUT_BRS232_RX5: J6.9 ; port OUT_BRS232_RX5
OUT_BRS232_RX6: J7.9 ; port OUT_BRS232_RX6
OUT_BRS232_RX7: J8.9 ; port OUT_BRS232_RX7
OUT_BRS232_TX0: J1.4 ; port OUT_BRS232_TX0
OUT_BRS232_TX1: J2.4 ; port OUT_BRS232_TX1
OUT_BRS232_TX2: J3.4 ; port OUT_BRS232_TX2
OUT_BRS232_TX3: J4.4 ; port OUT_BRS232_TX3
OUT_BRS232_TX4: J5.4 ; port OUT_BRS232_TX4
OUT_BRS232_TX5: J6.4 ; port OUT_BRS232_TX5
OUT_BRS232_TX6: J7.4 ; port OUT_BRS232_TX6
OUT_BRS232_TX7: J8.4 ; port OUT_BRS232_TX7
TCK_B: J9.1 ; port TCK_B
TDI_B: J9.3 ; port TDI_B
TDO_B: J9.9 ; port TDO_B
TMS_B: J9.5 ; port TMS_B

Not connected (* = marked no-connect by the designer): J1 3 8; J2 3 8; J3 3 8; J4 3 8; J5 3 8; J6 3 8; J7 3 8; J8 3 8; J9 6 7 8; U2 1(E/D)

### Notes on the sheet
- (near C6) mounting holes
  test points
  fiducials

### Library data of the parts
J9 = Header 5X2: Header, 5-Pin, Dual row; LatestRevisionDate: 17-Jul-2002; LatestRevisionNote: Re-released for DXP Platform.; Publisher: Altium Limited
J1-J8 = D09S33E4GV00LF: Supplier 1: Digi-Key; Supplier Part Number 1: 609-5184-ND
U2 = ASEMB-100.000MHZ-LY-T: Supplier 1: Digi-Key; Supplier Part Number 1: 535-11083-1-ND

## Sheet Mechanical.SchDoc
size A; DocumentNumber: 12; SheetNumber: 12
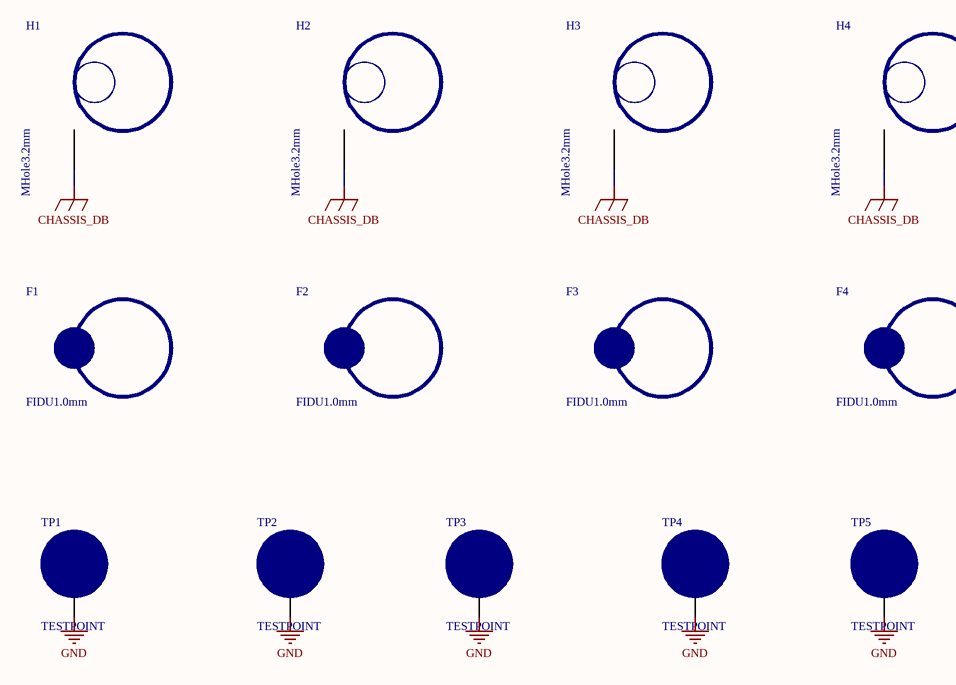
[diagram p11: Mechanical.SchDoc]

### Parts
F1  FIDU1.0mm  [FIDU1.0mm]
F2  FIDU1.0mm  [FIDU1.0mm]
F3  FIDU1.0mm  [FIDU1.0mm]
F4  FIDU1.0mm  [FIDU1.0mm]
H1  MHole3.2mm  [Mhole3.2mm - duplicate]
H2  MHole3.2mm  [Mhole3.2mm - duplicate]
H3  MHole3.2mm  [Mhole3.2mm - duplicate]
H4  MHole3.2mm  [Mhole3.2mm - duplicate]
TP1  TESTPOINT  [TESTPOINT]
TP2  TESTPOINT  [TESTPOINT]
TP3  TESTPOINT  [TESTPOINT]
TP4  TESTPOINT  [TESTPOINT]
TP5  TESTPOINT  [TESTPOINT]

### Nets
CHASSIS_DB: H1.1 H2.1 H3.1 H4.1
GND: TP1.1 TP2.1 TP3.1 TP4.1 TP5.1

### Library data of the parts
TP1-TP5 = TESTPOINT: 20-2137 1.02mm TP / FARNELL: 8731128